# EAGLE board node6.9.16-frontend (EAGLE 5.10), part 1 of 2
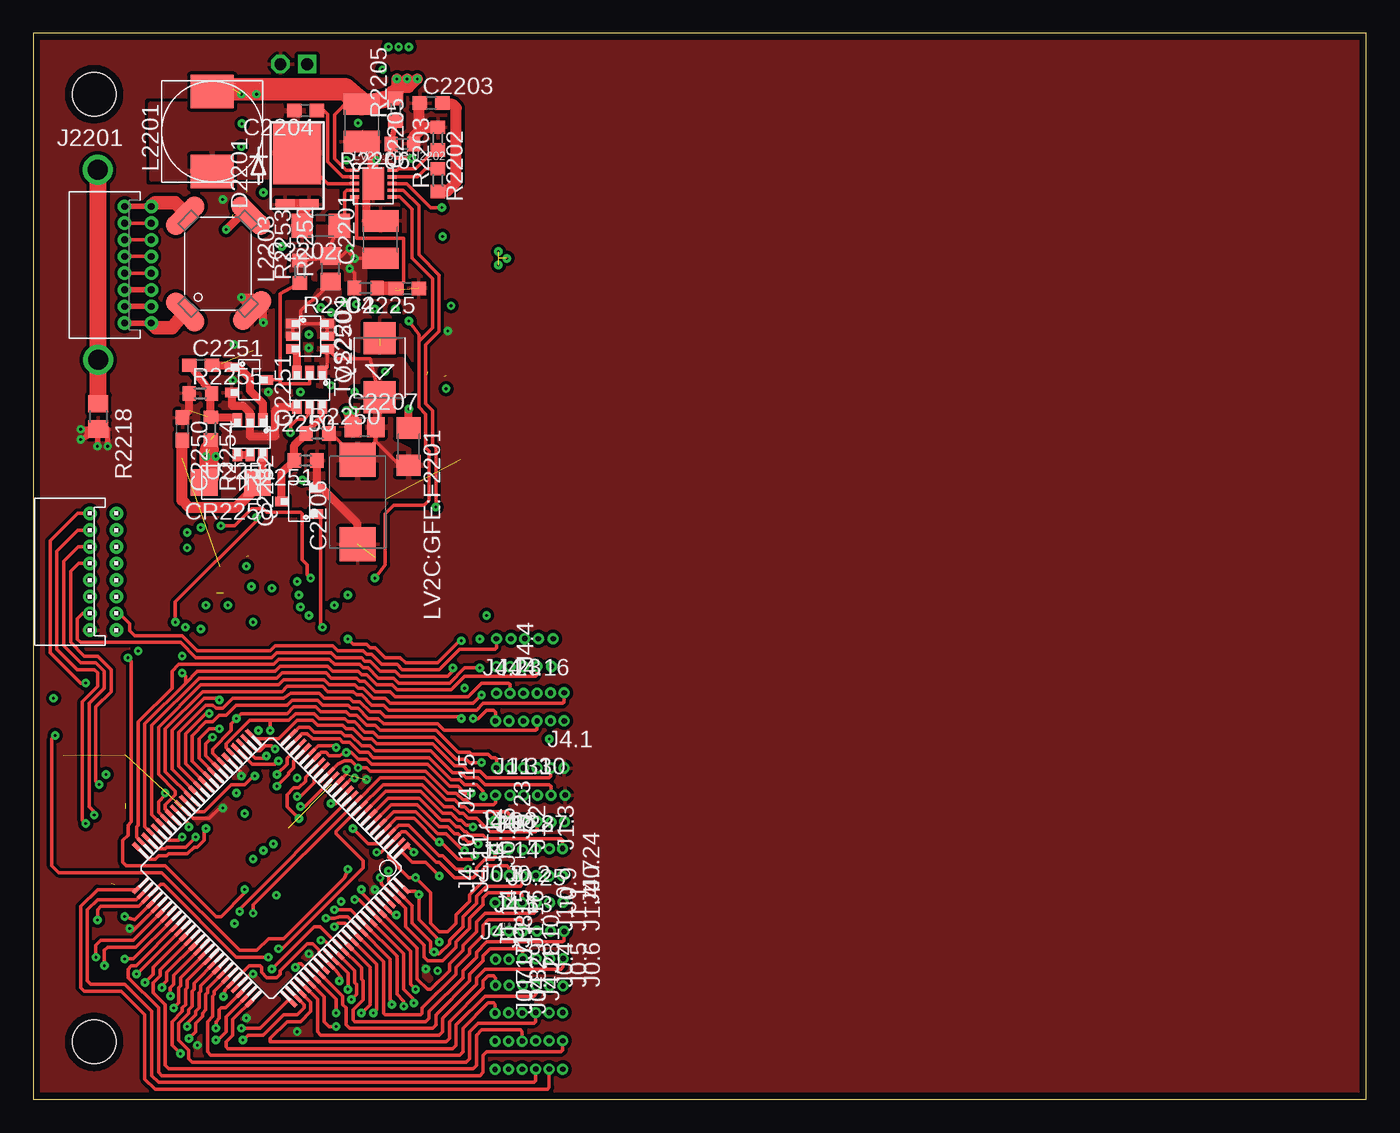
[diagram p2: board, top side]
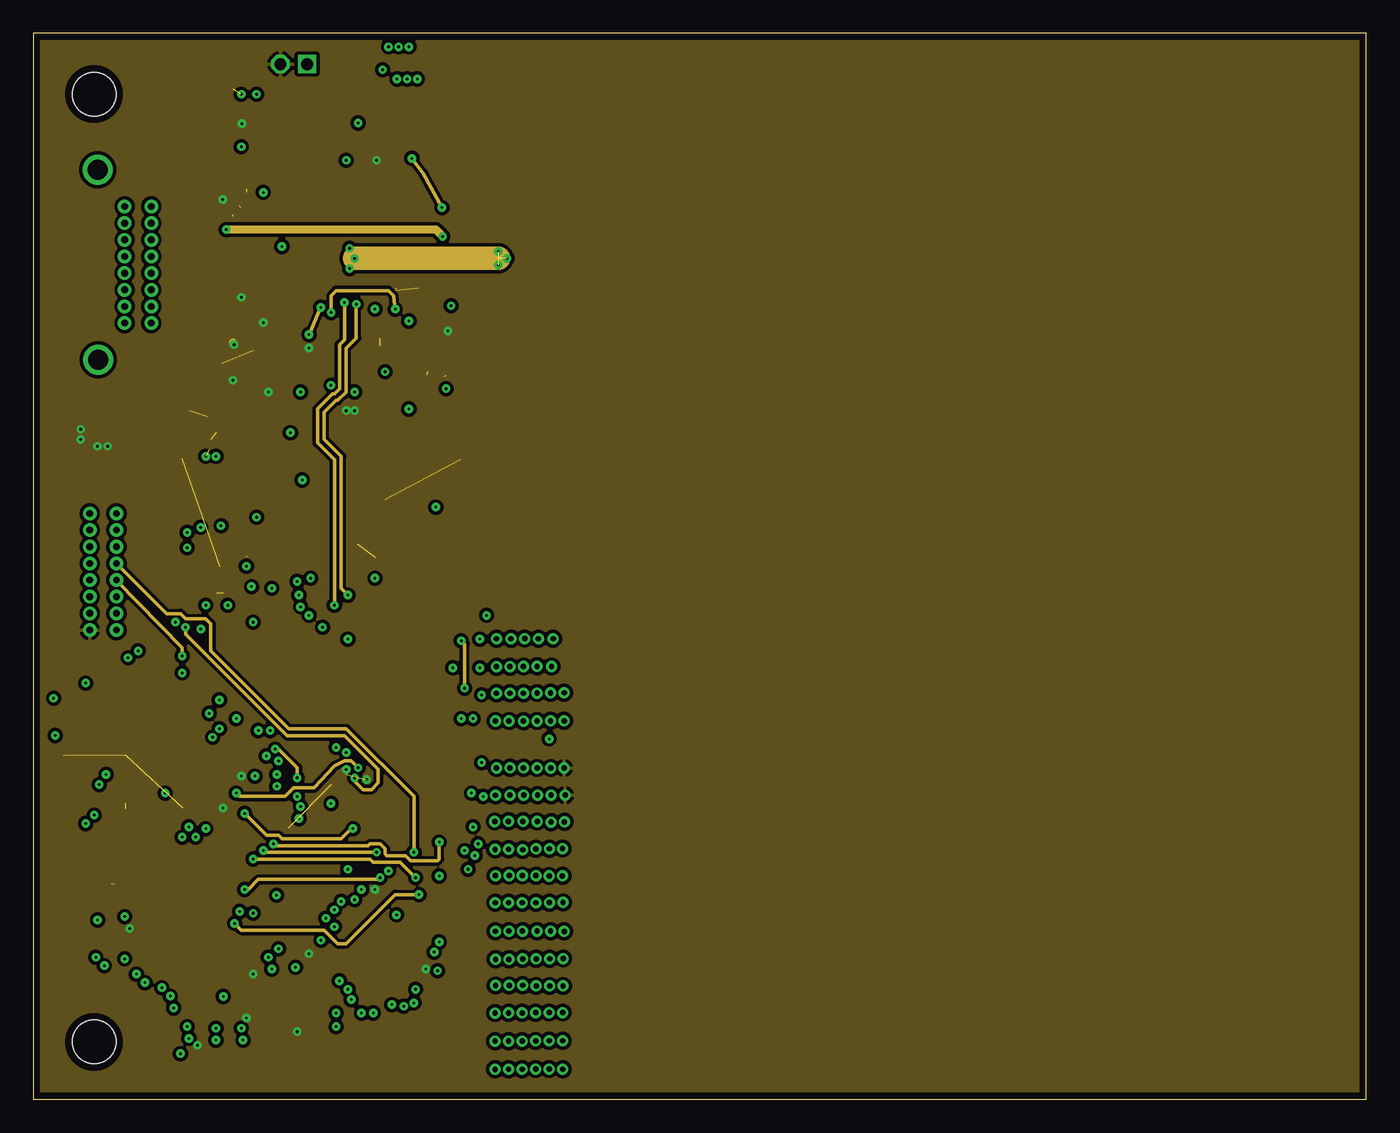
[diagram p3: board, inner layer Route2]
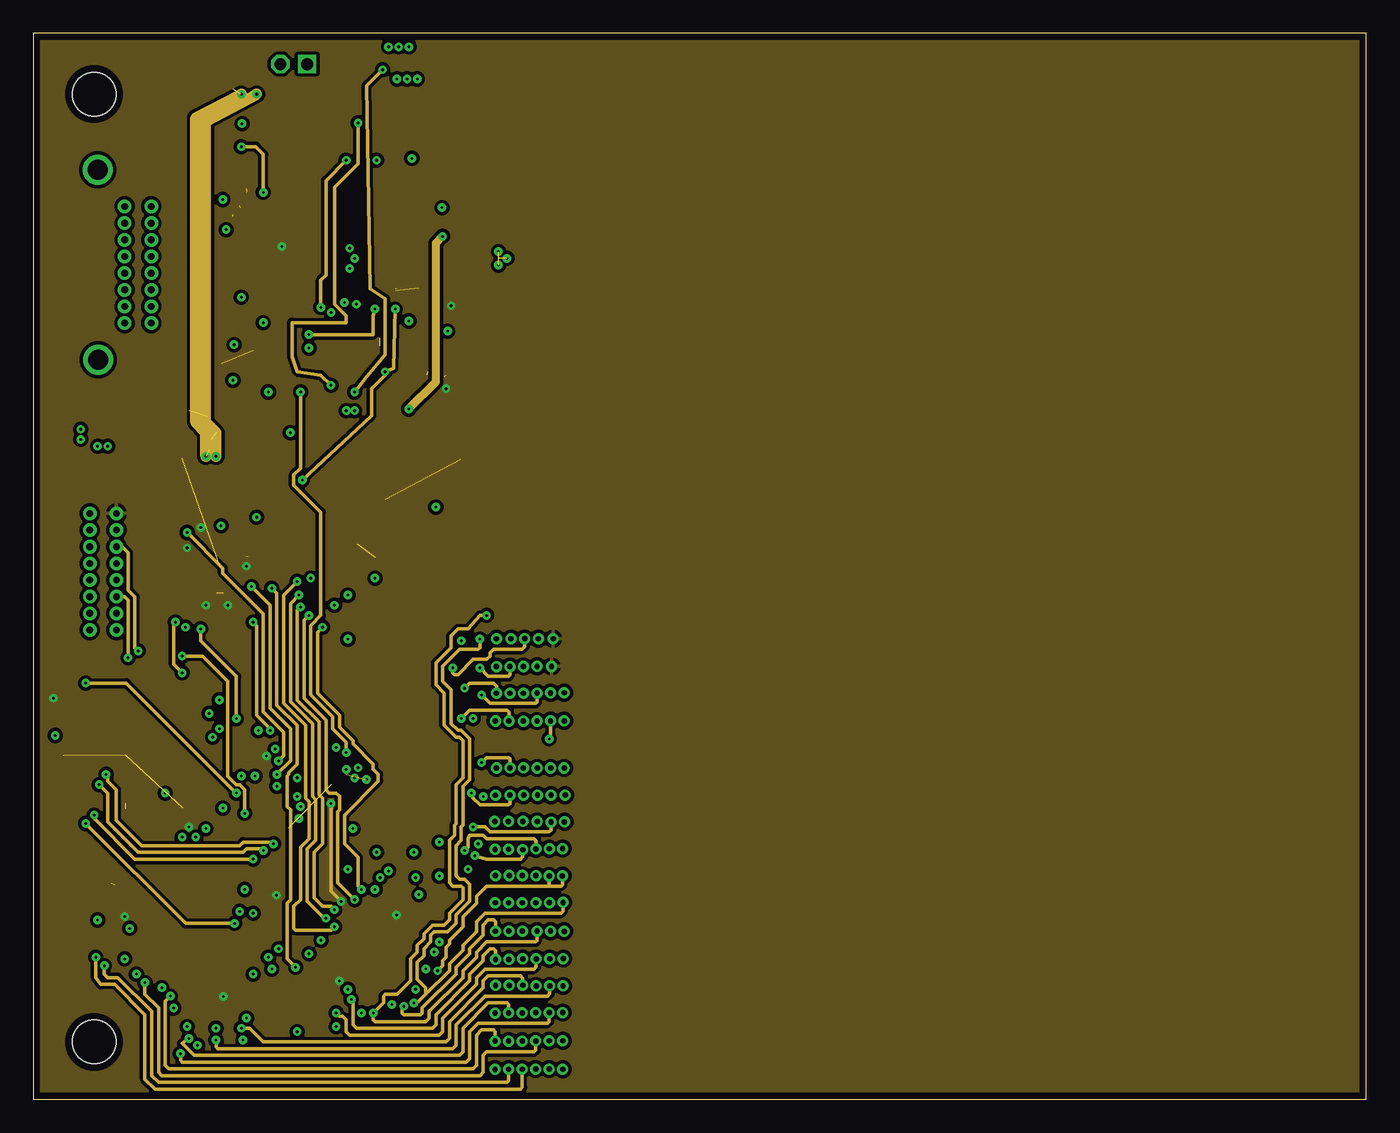
[diagram p4: board, inner layer Route15]
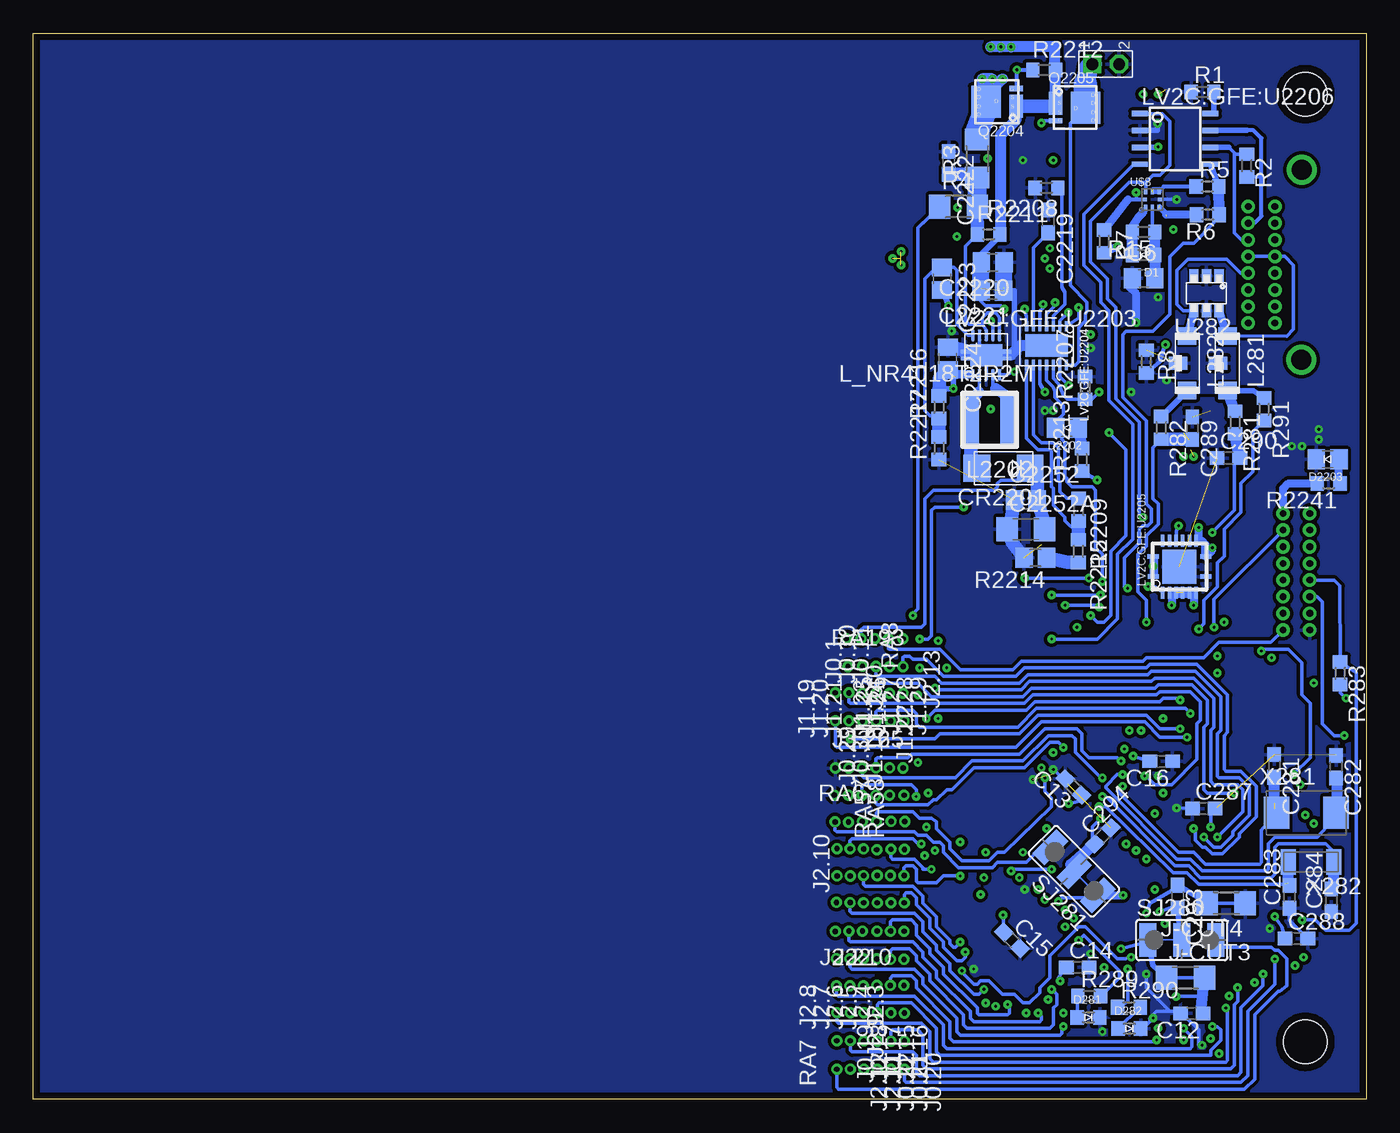
[diagram p5: board, bottom side, seen from below]

Size 100.08 x 80.01 mm. Coordinates in mm from the lower left corner, seen from the top.
Outline: 0,0 100.08,0 100.08,80.01 0,80 0,0
Copper layers (1+2*15+16): Top 0.0432mm / dielectric 0.3048mm / Route2 0.0356mm / dielectric 0.7112mm / Route15 0.0356mm / dielectric 0.3023mm / Bottom 0.0432mm
Design rules "sunstone_4lr_rules_v1.3_modifid *": minimum track width 6mil, minimum drill 8mil, track to track 6mil, track to pad 6mil, pad to pad 6mil, via to via 6mil, smd to smd 6mil, copper to edge 20mil, drill to drill 16mil, minimum pad ring 0.2118mm, minimum via ring 0.2118mm, stop-mask expansion 3mil, vias tented up to drill 0mil, thermal gap 10mil

## Footprints (pad centres in the part's own frame; a part is rotated, then mirrored left to right if it is on the bottom)
2MM-1X2-HEADER = drill 0.889 pad 1.372 square: 1 0,-1 | drill 0.889 pad 1.372 octagon: 2 0,1
C0805 = smd 1.3 x 1.5: 1 -0.85,0; 2 0.85,0
C0603 = smd 1.1 x 1: 1 -0.85,0; 2 0.85,0
C1210 = smd 1.6 x 2.7: 1 -1.4,0; 2 1.4,0
C1206 = smd 1.6 x 1.8: 1 -1.4,0; 2 1.4,0
D/7343-31R = smd 2.55 x 2.7: + 3.175,0; - -3.175,0
NMINIP2-J1 = smd 2 x 2: A 2,0; C -2,0
0603-DIODE = smd 1 x 1.1: A -0.85,0; K 0.85,0
D_POWERDI5 = smd 0.8 x 1.4: ANODE1 -3.47,-0.8; ANODE2 -3.47,1 | smd 4.7 x 3.6: CATHODE 0.4,0.1
0805-DIODE = smd 1.3 x 1.5: 1(ANODE) -0.85,0; 2(CATHODE) 0.85,0
0805-DIODE@1 = smd 1.3 x 1.5: 1(ANODE) -0.85,0; 2(CATHODE) 0.85,0
PAD_ROUND-APC-FREE_0.1/016 = drill 0.406 round: PAD 0,0
ROCKETBUS-PKG = drill 0.508 pad 1.016 round: AUX_1@1 0,-1.875; AUX_1@2 2,-1.875; AUX_2@1 0,-3.125; AUX_2@2 2,-3.125; B+@1 0,4.375; B+@2 2,4.375; B-@1 0,-4.375; B-@2 2,-4.375; CAN_H@1 0,3.125; CAN_H@2 2,3.125; CAN_L@1 0,1.875; CAN_L@2 2,1.875; USB_H@1 0,0.625; USB_H@2 2,0.625; USB_L@1 0,-0.625; USB_L@2 2,-0.625 | drill 1.511 round: CHASSIS@1 -2.032,7.136; CHASSIS@2 -1.982,-7.136
JST-16PS-JED = drill 0.508 pad 1.016 round: 1 4.375,-2; 2 4.375,0; 3 3.125,-2; 4 3.125,0; 5 1.875,-2; 6 1.875,0; 7 0.625,-2; 8 0.625,0; 9 -0.625,-2; 10 -0.625,0; 11 -1.875,-2; 12 -1.875,0; 13 -3.125,-2; 14 -3.125,0; 15 -4.375,-2; 16 -4.375,0
ZJ1206B = smd 1.6 x 1.803: 1 -1.422,0; 2 1.422,0
STAND-OFF = hole 3.302: 0,0
EXC-CET@1 = smd 1.3 x 1.4: 1 -2.05,0; 2 2.05,0 | smd 1 x 1.4: C 0,-0.7
L-DR74 = smd 2.5 x 3.25: 1 -3,0; 2 3,0
L_NR4018 = smd 1.2 x 3.7: 1 -1.4,0; 2 1.4,0
CMS1 = smd 3.5 x 1.5 rotated 45: 1 3.608,-2.462; 3 -3.608,2.462 | smd 3.5 x 1.5 rotated 315: 2 3.508,2.562; 4 -3.608,-2.462
1206 = smd 1.6 x 1.8: 1 -1.4,0; 2 1.4,0
LQFP100 = smd 0.28 x 1.5: #RESET 2,-7.9; #RSTOUT 0.5,-7.9; #TRST -4.5,-7.9; P0[15]/TXD1/SCK0/SCK 0.5,7.9; P0[16]/RXD1/SSEL0/SSEL 0,7.9; P0[17]/CTS1/MISO0/MISO 1,7.9; P0[18]/DCD1/MOSI0/MOSI 1.5,7.9; P0[19]/DSR1/MCICLK/SDA1 2,7.9; P0[20]/DTR1/MCICMD/SCL1 2.5,7.9; P0[21]/RI1/MCIPWR/RD1 3,7.9; P0[22]/RTS1/MCIDAT0/TD1 3.5,7.9; P0[23]/AD0[0]/I2SRX_CLK/CAP3[0] -2,-7.9; P0[24]/AD0[1]/I2SRX_WS/CAP3[1] -2.5,-7.9; P0[25]/AD0[2]/I2SRX_SDA/TXD3 -3,-7.9; P0[26]/AD0[3]/AOUT/RXD3 -3.5,-7.9; P0[27]/SDA0 6,-7.9; P0[28]/SCL0 5.5,-7.9; P1[30]/VBUS/AD0[4] 4,-7.9; P1[31]/SCK1/AD0[5] 3.5,-7.9; P2[0]/PWM1[1]/TXD1/TRACECLK -6,7.9; P2[1]/PWM1[2]/RXD1/PIPESTAT0 -5.5,7.9; P2[2]/PWM1[3]/CTS1/PIPESTAT1 -5,7.9; P2[3]/PWM1[4]/DCD1/PIPESTAT2 -3.5,7.9; P2[4]/PWM1[5]/DSR1/TRACESYNC -3,7.9; P2[5]/PWM1[6]/DTR1/TRACEPKT0 -2.5,7.9; P2[6]/PCAP1[0]/RI1/TRACEPKT1 -2,7.9; P2[7]/RD2/RTS1/TRACEPKT2 -1.5,7.9; P2[8]/TD2/TXD2/TRACEPKT3 -1,7.9; P2[9]/USB_CONNECT/RXD2/EXTIN0 -0.5,7.9; P2[10]/#EINT0 5,7.9; P2[11]/#EINT1/MCIDAT1/I2STX_CLK 5.5,7.9; P2[12]/#EINT2/MCIDAT2/I2STX_WS 6,7.9; RTCX1 1.5,-7.9; RTCX2 2.5,-7.9; TCK -4,-7.9; TDI -5.5,-7.9; TDO -6,-7.9; TMS -5,-7.9; VBAT 3,-7.9; VDD(3V3)@1 4.5,7.9; VDD(3V3)@2 -4,7.9; VDD(DCDC)(3V3) 0,-7.9; VDDA -1.5,-7.9; VREF -0.5,-7.9; VSS 1,-7.9; VSS@3 4,7.9; VSS@4 -4.5,7.9; VSSA -1,-7.9; XTAL1 4.5,-7.9; XTAL2 5,-7.9 | smd 1.5 x 0.28: P0[0]/RD1/TXD3/SDA1 7.9,4; P0[1]/TD1/RXD3/SCL1 7.9,4.5; P0[2]/TXD0 -7.9,-5; P0[3]/RXD0 -7.9,-5.5; P0[4]/I2SRX_CLK/RD2/CAP2[0] -7.9,3.5; P0[5]/I2SRX_WS/TD2/CAP2[1] -7.9,4; P0[6]/I2SRX_SDA/SSEL1/MAT2[0] -7.9,4.5; P0[7]/I2STX_CLK/SCK1/MAT2[1] -7.9,5; P0[8]/I2STX_WS/MISO1/MAT2[2] -7.9,5.5; P0[9]/I2STX_SDA/MOSI1/MAT2[3] -7.9,6; P0[10]/TXD2/SDA2/MAT3[0] 7.9,5; P0[11]/RXD2/SCL2/MAT3[1] 7.9,5.5; P0[29]/USB_D+ 7.9,-4.5; P0[30]/USB_D- 7.9,-4; P1[0]/ENET_TXD0 -7.9,-3.5; P1[1]/ENET_TXD1 -7.9,-3; P1[4]/ENET_TX_EN -7.9,-2.5; P1[8]/ENET_CRS -7.9,-2; P1[9]/ENET_RXD0 -7.9,-1.5; P1[10]/ENET_RXD1 -7.9,-1; P1[14]/ENET_RX_ER -7.9,-0.5; P1[15]/ENET_REF_CLK -7.9,0; P1[16]/ENET_MDC -7.9,0.5; P1[17]/ENET_MDIO -7.9,1; P1[18]/USB_UP_LED/PWM1[1]/CAP1[0] 7.9,-3; P1[19]/CAP1[1] 7.9,-2.5; P1[20]/PWM1[2]/SCK0 7.9,-2; P1[21]/PWM1[3]/SSEL0 7.9,-1.5; P1[22]MAT1[0] 7.9,-1; P1[23]/PWM1[4]/MISO0 7.9,-0.5; P1[24]/PWM1[5]/MOSI0 7.9,0; P1[25]/MAT1[1] 7.9,0.5; P1[26]/PWM1[6]/CAP0[0] 7.9,1; P1[27]/CAP0[1] 7.9,2.5; P1[28]/PCAP1[0]/MAT0[0] 7.9,3; P1[29]/PCAP1[1]/MAT0[1] 7.9,3.5; P2[13]/#EINT3/MCIDAT3/I2STX_SDA 7.9,6; P3[25]/MAT0[0]/PWM1[2] 7.9,-5.5; P3[26]/MAT0[1]/PWM1[3] 7.9,-6; P4[28]/MAT2[0]/TXD3 -7.9,3; P4[29]/MAT2[1]/RXD3 -7.9,1.5; RTCK -7.9,-6; VDD(3V3) 7.9,-5; VDD(3V3)@3 -7.9,-4; VDD(DCDC)(3V3)@1 7.9,2; VDD(DCDC)(3V3)@2 -7.9,2; VSS@1 7.9,-3.5; VSS@2 7.9,1.5; VSS@5 -7.9,-4.5; VSS@6 -7.9,2.5
DFN-10 = smd 0.25 x 0.675: BD -1,-1.413; BOOST -0.5,-1.413; FB 0,1.413; PG 0.5,1.413; RT -1,1.413; RUN/SS 1,-1.413; SW 0,-1.413; SYNC 1,1.413; VC -0.5,1.413; VIN 0.5,-1.413 | smd 2.38 x 1.65: GND 0,0
SON-10 = smd 0.28 x 0.85: EN 1,1.475; FB -1,1.475; GND -0.5,1.475; L1 0.5,-1.475; L2 -0.5,-1.475; PGND 0,-1.475; PS/SYNC 0.5,1.475; VIN 1,-1.475; VINA 0,1.475; VOUT -1,-1.475 | smd 2.4 x 1.65: PGND@1 0,0 | smd 3.8 x 0.28: PGND@2 0,0.25; PGND@3 0,-0.25
DFN-14 = smd 0.25 x 0.7: 1 -1.5,-1.45; 2 -1,-1.45; 3 -0.5,-1.45; 4 0,-1.45; 5 0.5,-1.45; 6 1,-1.45; 7 1.5,-1.45; 8 1.5,1.45; 9 1,1.45; 10 0.5,1.45; 11 0,1.45; 12 -0.5,1.45; 13 -1,1.45; 14 -1.5,1.45 | smd 3.3 x 1.7: PGND 0,0
QFN-16 = smd 0.85 x 0.28: 1 -1.97,-0.75; 8 1.97,-0.74; 9 1.97,0.75; 16 -1.98,0.75 | smd 0.28 x 0.85: 2 -1.25,-1.95; 3 -0.75,-1.95; 4 -0.25,-1.95; 5 0.25,-1.95; 6 0.75,-1.95; 7 1.25,-1.95; 10 1.25,1.95; 11 0.75,1.95; 12 0.25,1.95; 13 -0.25,1.95; 14 -0.75,1.95; 15 -1.25,1.95 | smd 2.55 x 2.55: PGND 0,0
DR-PDSO-G8 = smd 0.4 x 1.2: 1 -1.905,-2.65; 2 -0.635,-2.65; 3 0.635,-2.65; 4 1.905,-2.65; 5 1.905,2.65; 6 0.635,2.65; 7 -0.635,2.65; 8 -1.905,2.65
1212-8_POWERPAK = smd 0.99 x 1.725: 1-2-3 -1.45,0.33 | smd 0.99 x 0.405: 4 -1.45,-0.99 | smd 2.24 x 2.39: 5-6-7-8 0.797,0
SOT23-6 = smd 0.7 x 1: 1 -0.95,-1.3; 2 0,-1.3; 3 0.95,-1.3; 4 0.95,1.3; 5 0,1.3; 6 -0.95,1.3
SOT23-3 = smd 0.7 x 1: 1 -0.95,-1.3; 2 0.95,-1.3; 3 0,1.3
R0603 = smd 1 x 1.1: 1 -0.85,0; 2 0.85,0
R1206 = smd 1.6 x 1.803: 1 -1.422,0; 2 1.422,0
R0805 = smd 1.3 x 1.5: 1 -0.85,0; 2 0.85,0
R0805' = smd 1.3 x 1.5: 1 -0.95,0; 2 0.95,0
SJ_2W = smd 1.27 x 2.54: 1 -2.54,0; 2 0,0; 3 2.54,0
SMB = smd 2.4 x 2.4: A 2.2,0; C -2.2,0
MICROPAK-8 = smd 0.25 x 0.4: 1 -0.5,-0.61; 2 0,-0.61; 3 0.5,-0.61; 5 0.5,0.61; 6 0,0.61; 7 -0.5,0.61 | smd 0.4 x 0.25: 4 0.6,0; 8 -0.6,0
CS10 = smd 1.905 x 2.413: P$1 -2.235,0; P$2 2.235,0
CM415 = smd 1.118 x 1.905: P$1 -1.702,0; P$2 1.702,0

## Placement (x,y rotation side)
B1  BATTERY_SINGLE_CELL_2MM  [2MM-1X2-HEADER]  19.56,77.7 270 bottom
C6  76nF  [C0805]  16.71,61.62 0 bottom
C12  0.1  [C0603]  13.09,6.45 180 bottom
C13  0.1  [C0603]  22,23.44 135 bottom
C14  0.1  [C0603]  21.67,9.91 0 bottom
C15  0.1  [C0603]  26.61,11.94 315 bottom
C16  0.1  [C0603]  15.39,25.37 180 bottom
C281  39 pF  [C0603]  6.91,25.02 270 bottom
C282  33 pF  [C0603]  2.26,24.97 270 bottom
C283  22 pF  [C0603]  5.77,15.19 90 bottom
C284  22 pF  [C0603]  2.62,14.94 90 bottom
C287  0.1  [C0603]  12.19,21.82 0 bottom
C288  0.1  [C0603]  5.23,12.06 0 bottom
C289  18pF  [C0603]  13.06,50.37 270 bottom
C290  18pF  [C0603]  10.34,48.13 0 bottom
C293  0.1  [C0603]  14.17,15.21 270 bottom
C294  0.1  [C0603]  19.78,19.77 45 bottom
C2201  10uF  [C1210]  26.06,64.53 90 top
C2202  1uF  [C1206]  21.59,65.56 180 top
C2203  680pF  [C0603]  29.87,74.77 0 top
C2204  0.22uF  [C0603]  20.44,74.22 180 top
C2205  22uF  [C1210]  24.67,73.28 270 top
C2206  22  [D/7343-31R]  24.35,44.83 90 top
C2207  0.33  [C0805]  24.87,50.44 0 top
C2219  depends on bat  [C0603]  23.88,65.89 270 bottom
C2220  4.7uF  [C0805]  28.04,62.81 180 bottom
C2221  4.7uF  [C0805]  28.07,60.71 180 bottom
C2222  0.1uF  [C0603]  31.34,70.28 270 bottom
C2223  2pF  [C0805]  31.85,61.59 270 bottom
C2224  22uF  [C0805]  31.42,55.6 270 bottom
C2225  0.1uF  [C0603]  28.09,60.86 180 top
C2250  2.7  [C0603]  11.2,50.32 270 top
C2251  0.015  [C0603]  12.57,55.09 0 top
C2252  TBD  [C0805]  25.55,44.98 0 bottom
C2252A  TBD  [C1206]  25.55,42.8 0 bottom
CR2201  MA2Q705  [NMINIP2-J1]  27.23,47.37 180 bottom
CR2250  MA2Q705  [NMINIP2-J1]  14.83,46.3 180 top
D1  CDSU101A  [0603-DIODE]  16.71,63.37 180 bottom
D281  LED-RED-0603  [0603-DIODE]  20.85,6.15 0 bottom
D282  LED-GRN-  [0603-DIODE]  17.78,5.31 0 bottom
D2201  D_PDS340  [D_POWERDI5]  19.91,70.63 90 top
D2202  LED-RED-0805  [0805-DIODE]  22.48,50.39 180 bottom
D2203  LED-ORG-0805  [0805-DIODE@1]  2.9,48.03 180 bottom
J0.0  PAD_ROUND016  [PAD_ROUND-APC-FREE_0.1/016]  34.77,30.48 90 bottom
J0.1  PAD_ROUND016  [PAD_ROUND-APC-FREE_0.1/016]  37.82,32.5 90 bottom
J0.2  PAD_ROUND016  [PAD_ROUND-APC-FREE_0.1/016]  36.7,14.76 0 top
J0.3  PAD_ROUND016  [PAD_ROUND-APC-FREE_0.1/016]  34.68,14.76 0 top
J0.4  PAD_ROUND016  [PAD_ROUND-APC-FREE_0.1/016]  37.76,10.54 270 top
J0.5  PAD_ROUND016  [PAD_ROUND-APC-FREE_0.1/016]  38.77,10.55 270 top
J0.6  PAD_ROUND016  [PAD_ROUND-APC-FREE_0.1/016]  39.79,10.57 270 top
J0.7  PAD_ROUND016  [PAD_ROUND-APC-FREE_0.1/016]  34.71,8.55 270 top
J0.8  PAD_ROUND016  [PAD_ROUND-APC-FREE_0.1/016]  35.73,8.55 270 top
J0.9  PAD_ROUND016  [PAD_ROUND-APC-FREE_0.1/016]  36.74,8.56 270 top
J0.10  PAD_ROUND016  [PAD_ROUND-APC-FREE_0.1/016]  36.8,32.49 90 bottom
J0.11  PAD_ROUND016  [PAD_ROUND-APC-FREE_0.1/016]  35.79,32.47 90 bottom
J0.15  PAD_ROUND016  [PAD_ROUND-APC-FREE_0.1/016]  36.7,4.37 270 bottom
J0.16  PAD_ROUND016  [PAD_ROUND-APC-FREE_0.1/016]  35.69,4.37 270 bottom
J0.17  PAD_ROUND016  [PAD_ROUND-APC-FREE_0.1/016]  37.72,4.38 270 bottom
J0.18  PAD_ROUND016  [PAD_ROUND-APC-FREE_0.1/016]  38.73,4.39 270 bottom
J0.19  PAD_ROUND016  [PAD_ROUND-APC-FREE_0.1/016]  39.75,4.39 270 bottom
J0.20  PAD_ROUND016  [PAD_ROUND-APC-FREE_0.1/016]  34.67,2.25 270 bottom
J0.21  PAD_ROUND016  [PAD_ROUND-APC-FREE_0.1/016]  35.69,2.26 270 bottom
J0.22  PAD_ROUND016  [PAD_ROUND-APC-FREE_0.1/016]  36.7,2.26 270 bottom
J0.23  PAD_ROUND016  [PAD_ROUND-APC-FREE_0.1/016]  38.87,20.8 90 top
J0.24  PAD_ROUND016  [PAD_ROUND-APC-FREE_0.1/016]  39.74,18.82 270 top
J0.25  PAD_ROUND016  [PAD_ROUND-APC-FREE_0.1/016]  38.75,18.81 180 top
J0.26  PAD_ROUND016  [PAD_ROUND-APC-FREE_0.1/016]  37.73,18.8 90 top
J0.27  PAD_ROUND016  [PAD_ROUND-APC-FREE_0.1/016]  38.87,22.83 180 top
J0.28  PAD_ROUND016  [PAD_ROUND-APC-FREE_0.1/016]  37.86,22.83 180 top
J0.29  PAD_ROUND016  [PAD_ROUND-APC-FREE_0.1/016]  36.8,24.88 90 bottom
J0.30  PAD_ROUND016  [PAD_ROUND-APC-FREE_0.1/016]  35.79,24.88 90 bottom
J1.0  PAD_ROUND016  [PAD_ROUND-APC-FREE_0.1/016]  37.74,14.75 270 top
J1.1  PAD_ROUND016  [PAD_ROUND-APC-FREE_0.1/016]  38.76,14.76 270 top
J1.2  PAD_ROUND016  [PAD_ROUND-APC-FREE_0.1/016]  35.67,20.87 270 top
J1.3  PAD_ROUND016  [PAD_ROUND-APC-FREE_0.1/016]  37.83,20.85 270 top
J1.4  PAD_ROUND016  [PAD_ROUND-APC-FREE_0.1/016]  39.77,14.78 270 top
J1.8  PAD_ROUND016  [PAD_ROUND-APC-FREE_0.1/016]  34.69,12.62 270 top
J1.9  PAD_ROUND016  [PAD_ROUND-APC-FREE_0.1/016]  35.71,12.63 270 top
J1.10  PAD_ROUND016  [PAD_ROUND-APC-FREE_0.1/016]  36.72,12.63 270 top
J1.14  PAD_ROUND016  [PAD_ROUND-APC-FREE_0.1/016]  37.82,12.62 90 top
J1.15  PAD_ROUND016  [PAD_ROUND-APC-FREE_0.1/016]  38.84,12.62 90 top
J1.16  PAD_ROUND016  [PAD_ROUND-APC-FREE_0.1/016]  39.85,12.61 90 top
J1.17  PAD_ROUND016  [PAD_ROUND-APC-FREE_0.1/016]  34.71,10.5 270 top
J1.18  PAD_ROUND016  [PAD_ROUND-APC-FREE_0.1/016]  34.77,24.87 90 bottom
J1.19  PAD_ROUND016  [PAD_ROUND-APC-FREE_0.1/016]  39.85,28.41 90 bottom
J1.20  PAD_ROUND016  [PAD_ROUND-APC-FREE_0.1/016]  38.84,28.41 90 bottom
J1.21  PAD_ROUND016  [PAD_ROUND-APC-FREE_0.1/016]  37.82,28.4 90 bottom
J1.22  PAD_ROUND016  [PAD_ROUND-APC-FREE_0.1/016]  36.8,28.38 270 bottom
J1.23  PAD_ROUND016  [PAD_ROUND-APC-FREE_0.1/016]  35.71,28.4 90 bottom
J1.24  PAD_ROUND016  [PAD_ROUND-APC-FREE_0.1/016]  34.7,28.4 90 bottom
J1.25  PAD_ROUND016  [PAD_ROUND-APC-FREE_0.1/016]  39.85,30.52 270 bottom
J1.26  PAD_ROUND016  [PAD_ROUND-APC-FREE_0.1/016]  38.84,30.51 270 bottom
J1.27  PAD_ROUND016  [PAD_ROUND-APC-FREE_0.1/016]  37.82,30.49 270 bottom
J1.28  PAD_ROUND016  [PAD_ROUND-APC-FREE_0.1/016]  36.8,30.48 270 bottom
J1.29  PAD_ROUND016  [PAD_ROUND-APC-FREE_0.1/016]  35.79,30.48 270 bottom
J1.30  PAD_ROUND016  [PAD_ROUND-APC-FREE_0.1/016]  36.82,22.83 0 top
J1.31  PAD_ROUND016  [PAD_ROUND-APC-FREE_0.1/016]  35.79,22.83 0 top
J2.0  PAD_ROUND016  [PAD_ROUND-APC-FREE_0.1/016]  37.76,8.51 0 bottom
J2.1  PAD_ROUND016  [PAD_ROUND-APC-FREE_0.1/016]  38.77,8.51 0 bottom
J2.2  PAD_ROUND016  [PAD_ROUND-APC-FREE_0.1/016]  39.78,8.51 0 bottom
J2.3  PAD_ROUND016  [PAD_ROUND-APC-FREE_0.1/016]  34.67,6.48 90 bottom
J2.4  PAD_ROUND016  [PAD_ROUND-APC-FREE_0.1/016]  35.69,6.49 90 bottom
J2.5  PAD_ROUND016  [PAD_ROUND-APC-FREE_0.1/016]  36.7,6.49 90 bottom
J2.6  PAD_ROUND016  [PAD_ROUND-APC-FREE_0.1/016]  37.72,6.5 90 bottom
J2.7  PAD_ROUND016  [PAD_ROUND-APC-FREE_0.1/016]  38.73,6.52 90 bottom
J2.8  PAD_ROUND016  [PAD_ROUND-APC-FREE_0.1/016]  39.75,6.52 90 bottom
J2.9  PAD_ROUND016  [PAD_ROUND-APC-FREE_0.1/016]  34.67,4.37 90 bottom
J2.10  PAD_ROUND016  [PAD_ROUND-APC-FREE_0.1/016]  38.73,16.76 90 bottom
J2.11  PAD_ROUND016  [PAD_ROUND-APC-FREE_0.1/016]  37.72,2.27 270 bottom
J2.12  PAD_ROUND016  [PAD_ROUND-APC-FREE_0.1/016]  38.73,2.27 270 bottom
J2.13  PAD_ROUND016  [PAD_ROUND-APC-FREE_0.1/016]  34.77,32.47 270 bottom
J3.25  PAD_ROUND016  [PAD_ROUND-APC-FREE_0.1/016]  37.83,24.87 0 bottom
J3.26  PAD_ROUND016  [PAD_ROUND-APC-FREE_0.1/016]  38.85,24.87 0 bottom
J4.1  PAD_ROUND016  [PAD_ROUND-APC-FREE_0.1/016]  39.85,24.87 0 top
J4.2  PAD_ROUND016  [PAD_ROUND-APC-FREE_0.1/016]  35.86,34.57 180 top
J4.3  PAD_ROUND016  [PAD_ROUND-APC-FREE_0.1/016]  36.89,34.58 180 top
J4.4  PAD_ROUND016  [PAD_ROUND-APC-FREE_0.1/016]  34.77,34.57 270 top
J4.5  PAD_ROUND016  [PAD_ROUND-APC-FREE_0.1/016]  36.72,16.8 180 top
J4.6  PAD_ROUND016  [PAD_ROUND-APC-FREE_0.1/016]  35.69,14.76 180 top
J4.7  PAD_ROUND016  [PAD_ROUND-APC-FREE_0.1/016]  39.73,16.78 270 top
J4.8  PAD_ROUND016  [PAD_ROUND-APC-FREE_0.1/016]  35.69,18.77 0 top
J4.9  PAD_ROUND016  [PAD_ROUND-APC-FREE_0.1/016]  34.67,18.76 0 top
J4.10  PAD_ROUND016  [PAD_ROUND-APC-FREE_0.1/016]  34.7,16.79 90 top
J4.11  PAD_ROUND016  [PAD_ROUND-APC-FREE_0.1/016]  35.73,16.8 90 top
J4.12  PAD_ROUND016  [PAD_ROUND-APC-FREE_0.1/016]  36.74,18.73 90 top
J4.13  PAD_ROUND016  [PAD_ROUND-APC-FREE_0.1/016]  37.74,16.79 180 top
J4.14  PAD_ROUND016  [PAD_ROUND-APC-FREE_0.1/016]  36.77,20.87 180 top
J4.15  PAD_ROUND016  [PAD_ROUND-APC-FREE_0.1/016]  34.7,22.82 90 top
J4.16  PAD_ROUND016  [PAD_ROUND-APC-FREE_0.1/016]  39.03,34.57 180 top
J4.28  PAD_ROUND016  [PAD_ROUND-APC-FREE_0.1/016]  36.74,10.54 270 top
J4.29  PAD_ROUND016  [PAD_ROUND-APC-FREE_0.1/016]  35.71,10.5 270 top
J2201  ROCKETBUS  [ROCKETBUS-PKG]  6.86,62.64 0 top
J2204  JST-16PS-JED  [JST-16PS-JED]  4.24,39.6 90 top
J-CUT3  J_CUT_1206  [ZJ1206B]  13.56,9.12 0 bottom
J-CUT4  J_CUT_1206  [ZJ1206B]  10.52,14.73 180 bottom
JP1  STAND-OFF  [STAND-OFF]  4.57,75.44 0 top
JP2  STAND-OFF  [STAND-OFF]  4.57,4.32 0 top
L281  EXC-CET471U  [EXC-CET@1]  10.41,55.24 270 bottom
L282  FILTER_EMI-EXC-CET  [EXC-CET@1]  13.44,55.24 270 bottom
L2201  L_DR74-6R8-R  [L-DR74]  13.43,72.64 90 top
L2202  L_NR4018T2R2M  [L_NR4018]  28.27,51.01 180 bottom
L2203  CMS1  [CMS1]  13.87,62.71 270 top
LV2C:GFE:F2201  2.0A Fast  [1206]  28.17,49 270 top
LV2C:GFE:U2201  IC_LPC2368  [LQFP100]  17.86,17.35 135 top
LV2C:GFE:U2202  IC_LT3972  [DFN-10]  25.52,68.74 270 top
LV2C:GFE:U2203  IC_TPS63000  [SON-10]  28.53,55.86 0 bottom
LV2C:GFE:U2204  IC_LTC4085  [DFN-14]  24,56.56 180 bottom
LV2C:GFE:U2205  IC_SN74LV163A  [QFN-16]  14.02,39.98 0 bottom
LV2C:GFE:U2206  IC_SN65HVD235  [DR-PDSO-G8]  14.35,72.09 270 bottom
Q2204  P-MOS_SI7123DN  [1212-8_POWERPAK]  27.73,74.87 180 bottom
Q2205  P-MOS_SI7123DN  [1212-8_POWERPAK]  21.86,74.43 0 bottom
Q2250  ZXMP6A17E6TA  [SOT23-6]  20.78,57.28 270 top
Q2251  BSS123E6327  [SOT23-3]  16.21,54 270 top
Q2282  BSS123E6327  [SOT23-3]  19.96,44.88 90 top
R1  18k  [R0603]  12.29,75.62 0 bottom
R2  60  [R0603]  8.97,70.08 270 bottom
R3  100k  [R1206]  29.21,70.61 90 bottom
R4  100k  [R1206]  30.61,67.01 0 bottom
R5  0  [R0603]  11.91,68.5 0 bottom
R6  0  [R0603]  11.89,66.4 180 bottom
R7  0  [R0603]  19.68,64.39 270 bottom
R8  0  [R0603]  16.51,55.37 270 bottom
R15  10k  [R0603]  16.71,65.1 180 bottom
R281  33.2  [R0603]  9.86,50.8 270 bottom
R282  33.2  [R0603]  15.39,50.39 270 bottom
R283  10.0k  [R0603]  1.96,31.98 270 bottom
R289  649  [R0603]  20.8,7.75 0 bottom
R290  649  [R0603]  17.81,6.91 0 bottom
R291  1.5k  [R0603]  7.67,51.79 270 bottom
R2202  26.7k  [R0603]  30.37,72.11 270 top
R2203  15k  [R0603]  30.38,68.99 90 top
R2204  500k  [R0603]  24.97,60.89 180 top
R2205  532k  [R0603]  27.21,74.27 90 top
R2206  100k  [R0603]  27.71,71.71 180 top
R2207  100k  [R0603]  21.11,53.39 90 bottom
R2208  660  [R0603]  24,68.4 180 bottom
R2209  115k 1%  [R0603]  21.59,44.25 270 bottom
R2211  100  [R0603]  28.35,64.92 0 bottom
R2212  1k  [R0603]  24.18,77.27 0 bottom
R2213  510  [R0603]  21.34,48.01 90 bottom
R2214  Thermistor-100k @25C  [R0805]  24.84,40.64 180 bottom
R2215  15k 1%  [R0603]  21.62,41.15 270 bottom
R2216  1.0M  [R0603]  32.08,51.94 90 bottom
R2217  200k  [R0603]  32.08,48.87 90 bottom
R2218  100k  [R0805']  4.88,51.26 270 top
R2241  649  [R0603]  2.82,46.23 180 bottom
R2250  61.9k  [R0603]  21.34,49.97 0 top
R2251  10.0k  [R0603]  20.45,47.94 180 top
R2252  0.82  [R0805']  22.32,62.34 90 top
R2253  47k  [R0603]  20.02,62.12 90 top
R2254  33.0k  [R0603]  13.34,50.34 270 top
R2255  10.0k  [R0603]  12.55,52.98 0 top
RA6  t24  [PAD_ROUND-APC-FREE_0.1/016]  39.88,20.83 0 bottom
RA7  t24  [PAD_ROUND-APC-FREE_0.1/016]  39.75,2.26 90 bottom
RA8  t24  [PAD_ROUND-APC-FREE_0.1/016]  37.92,34.57 270 bottom
RA57  t24  [PAD_ROUND-APC-FREE_0.1/016]  39.93,22.83 270 bottom
RA58  t24  [PAD_ROUND-APC-FREE_0.1/016]  34.65,20.85 90 bottom
RA193  3P3  [PAD_ROUND-APC-FREE_0.1/016]  38.91,32.49 0 bottom
SJ280  [SJ_2W]  13.84,11.96 0 bottom
SJ281  [SJ_2W]  21.93,17.11 135 bottom
TVS2201  SMBJ18A  [SMB]  26,54.91 90 top
U282  SN65220DBVR  [SOT23-6]  11.99,60.5 180 bottom
U2250  MAX5902AAETT  [SOT23-6]  20.75,53.26 180 top
U2251  TLV3012AIDBVT  [SOT23-6]  16.28,49.68 180 top
U$8  IC_NC7NP14  [MICROPAK-8]  16.05,67.54 0 bottom
X281  12.0 MHz  [CS10]  4.5,21.51 0 bottom
X282  32.768 kHz  [CM415]  4.14,17.81 180 bottom

## Tracks (layer width: path | path; a pad name or v marks a point on that pad's centre or on a via)
3.3V_HAP_OUT  (via drill 0.2)  (4 unrouted)
  Top 0.254: v22.98,8.89 23.11,9.14 22.73,9.65 LV2C:GFE:U2201.VDD(DCDC)(3V3)@2 21.46,10.91 21.46,11.18 20.95,11.68 20.57,11.68 18.54,9.65 18.54,9.4 18.29,9.14 17.53,9.14 17.14,9.53 17.14,9.91 17.02,10.03 16.2,10.03 LV2C:GFE:U2201.VDD(3V3)@2 14.39,8.23 v14.27,7.72 | LV2C:GFE:U2201.VDD(3V3)@1 7.61,13.46 v6.86,13.72 | LV2C:GFE:U2201.VDD(3V3)@3 27.02,13.84 v27.27,13.84 | v22.35,22.2 22.71,22.2 LV2C:GFE:U2201.VDD(DCDC)(3V3) | LV2C:GFE:U2201.VDD(3V3) 16.66,25.61 17.48,25.61 v17.5,25.77 | LV2C:GFE:U2201.VDD(DCDC)(3V3)@1 11.68,20.7 v11.68,20.45
  Route15 0.254: 22.35,22.23 22.35,15.62 v23.11,14.86
  Bottom 0.254: C2224.2 31.42,54.38 LV2C:GFE:U2203.VOUT | 29.59,54.23 30.86,54.23 | 29.59,54.61 30.99,54.61 | C16.2 v17.5,25.77 | C15.1 v27.27,13.84 | C14.1 22.73,9.65 23.11,9.14 v22.98,8.89 | LV2C:GFE:U2205.4 LV2C:GFE:U2205.3 14.61,38.12 | LV2C:GFE:U2205.7 12.95,38.1 | C12.1 12.37,7.48 12.62,7.72 v14.27,7.72 | C288.1 6.34,12.94 v6.86,13.72 | LV2C:GFE:U2205.1 15.99,39.74 v16,40.01 16,40.6 LV2C:GFE:U2205.16 | R283.2 1.96,30.53 v1.52,30.1 | v22.35,22.2 21.39,22.39 C13.1 | C287.2 11.75,21.46 11.68,21.4 11.68,20.83 v11.68,20.45 | v23.11,14.86 22.86,15.11 21.08,15.11 | 12.32,41.91 LV2C:GFE:U2205.10 12.57,42 | 16.13,40.77 15.75,40.77 15.75,39.24 16.13,39.24 16.13,40.77
  Bottom 0.406: C2223.2 31.75,60.64 v31.37,59.56 | C2224.2 30.99,54.32 v30.99,53.34 32,53.34
  Bottom 0.61: R7.2 19.3,63.75 v18.67,64.01 | 12.95,38.1 v12.95,37.08 | 14.61,38.12 v14.61,37.08 | SJ281.1 v18.26,15.32 | R2241.2 5.84,46.23 6.24,45.83 J2204.1 | v11.56,41.4 11.56,41.22 LV2C:GFE:U2205.9 12.06,40.74 12.06,41.66 12.32,41.91 | 12.57,42 v12.57,42.93
  Bottom 0.813: LV2C:GFE:U2205.6 LV2C:GFE:U2205.4 | C12.1 12.37,6.83 J-CUT3.2
  Bottom 1.016: R2216.2 32.05,54.09 C2224.2
  pour Route15 (isolate 0.254, rank 4): 0,80.01 100.08,80.01 100.08,0 0,0
!RESET!  (via drill 0.2)
  Top 0.254: J4.15.PAD 34.7,22.25 34.54,22.1 32.89,22.1 32.51,22.48 32.26,22.48 31.75,22.99 31.11,22.99 29.46,24.64 25.27,24.64 25.02,24.89 v24.38,24.89 23.88,25.4 23.37,25.4 22.86,25.15 22.73,25.05 LV2C:GFE:U2201.#RESET | J2204.2 3.33,43.97 1.27,41.91 1.27,33.53 3.56,31.24 v3.94,31.24
  Route2 0.254: v15.24,22.99 15.49,22.73 18.92,22.73 19.56,23.37 21.08,23.37 22.61,25.02 23.37,25.4 23.88,25.4 v24.38,24.89
  Route15 0.254: v3.94,31.24 6.99,31.24 v15.24,22.99
!RSTOUT!  (via drill 0.2)
  Top 0.254: LV2C:GFE:U2201.#RSTOUT 23.8,24 v24.13,24.13
  Route2 0.254: v11.43,35.43 11.43,34.92 19.05,27.3 23.37,27.3 25.91,24.77 25.91,23.75 25.4,23.24 24.77,23.24 24.13,23.88 v24.13,24.13
  Bottom 0.254: J4.14.PAD 36.77,21.53 36.7,21.59 34.04,21.59 33.53,21.08 32.64,21.08 32.26,20.83 32.26,20.32 31.24,19.3 31.24,18.8 30.35,17.91 28.32,17.91 27.69,18.54 27.18,18.54 23.62,21.97 23.62,22.61 24.13,23.11 v24.13,24.13 | J2204.3 11.43,37.53 v11.43,35.43
!SPS_POWER_PRESENT!  (via drill 0.2)
  Route15 0.254: v24.13,53.09 25.02,54.23 26.42,55.88 26.42,60.07 25.27,60.83 25.02,76.07 v26.23,77.28
  Bottom 0.254: LV2C:GFE:U2204.10 24.5,53.71 v24.13,53.09 | 26.28,77.27 26.24,77.27 v26.23,77.28
  Bottom 0.305: Q2204.4 26.28,77.27 R2212.1
!TRST!  (via drill 0.2)
  Top 0.254: v32.64,17.27 31.75,17.27 30.73,18.29 30.48,18.29 28.19,20.57 27.45,20.57 LV2C:GFE:U2201.#TRST 26.04,19.18 25.15,19.18 v24,20.32
  Route2 0.254: J2204.9 11.18,33.91 v11.18,33.27 | v15.88,21.46 17.53,19.81 18.41,19.81 18.67,19.56 23.11,19.56 23.88,20.32 v24,20.32
  Route15 0.254: v11.18,33.27 12.7,33.27 14.61,31.37 14.61,24.26 15.24,23.62 15.49,23.62 15.88,23.24 v15.88,21.46
  Bottom 0.254: v32.64,17.27 33.27,17.27 33.27,17.4 33.91,18.03 35.56,18.03 35.69,18.16 J4.8.PAD
A_3P3  (via drill 0.2)
  Top 0.254: v18.41,11.3 18.67,11.3 24.77,17.4 24.77,17.91 22.73,19.94 22.73,20.1 LV2C:GFE:U2201.VDDA 26.25,23.62 29.21,23.62 30.86,21.97 31.5,21.97 32,21.46 32.26,21.46 32.64,21.08 33.27,21.08 34.29,20.07 37.72,20.07 37.83,20.18 J1.3.PAD
  Bottom 0.254: SJ280.1 16.38,11.81 v18.41,11.3
  Bottom 0.406: SJ280.1 16,10.06 J-CUT3.1
A_GND  (via drill 0.2)
  Top 0.254: v16.51,13.97 16.51,14.59 LV2C:GFE:U2201.VSSA 26.05,24.13 29.34,24.13 30.99,22.48 31.62,22.48 32.13,21.97 32.38,21.97 32.77,21.59 34.54,21.59 | 34.54,21.59 35.56,21.59 35.67,21.48 J1.2.PAD | RA58.PAD 34.65,21.49 34.54,21.59
  Bottom 0.254: C293.1 13.91,16.07 16.26,14.73 v16.51,13.97
  Bottom 0.406: J-CUT4.2 13.91,15.94 C293.1
AUX_1.2
  Top 0.406: J2201.AUX_1@1 J2201.AUX_1@2
AUX_2.2
  Top 0.406: J2201.AUX_2@1 J2201.AUX_2@2
BATTERY_CHARGE
  Bottom 0.254: LV2C:GFE:U2204.14 21.85,55.11 21.59,55.37 21.59,57.91 21.08,58.42 21.08,58.93 20.95,59.18 20.95,59.82 22.23,61.09 22.23,73.27 Q2205.5-6-7-8
  Bottom 1.422: B1.1 20.83,77.44 21.08,76.2
  Bottom 1.778: 21.08,76.2 21.08,74.2 Q2205.5-6-7-8
BATTERY_CONNECT_CONTROL  (via drill 0.2)
  Route15 0.254: v22.35,53.59 21.59,54.36 19.81,54.61 19.43,55.75 19.43,58.29 23.5,58.29 23.5,58.8 22.61,59.69 22.61,68.45 24.38,70.23 v24.38,73.28
  Bottom 0.254: LV2C:GFE:U2204.13 23,54.24 v22.35,53.59 | Q2205.4 24.22,73.44 v24.38,73.28
BIAS_VOLTS_FOR_NTC_THERMISTOR
  Bottom 0.254: LV2C:GFE:U2204.9 25,49.89 24.38,49.28 23.5,49.28 23.11,48.9 23.11,46.48 22.99,46.35 22.99,45.59 22.49,45.1 R2209.1
BIN  (via drill 0.2)
  Top 0.61: LV2C:GFE:F2201.1 28.19,50.42 v28.19,51.82 | L2203.3 15.52,66.32 v14.48,65.28
  Route2 0.61: v14.48,65.28 30.23,65.28 v30.73,64.77
  Route15 0.61: v28.19,51.82 30.23,53.85 30.23,64.26 v30.73,64.77
CAN1_H
  Top 0.254: J2201.CAN_H@1 J2201.CAN_H@2
  Bottom 0.254: R2.2 8.02,69.23 7.87,69.09
  Bottom 0.305: J2201.CAN_H@2 8.41,65.76 7.87,66.29 7.87,69.09 7.87,72.14 8.46,72.72 8.97,72.72
  Bottom 0.406: 8.97,72.72 LV2C:GFE:U2206.7
CAN1_L
  Top 0.254: J2201.CAN_L@1 J2201.CAN_L@2
  Bottom 0.254: J2201.CAN_L@2 9.39,64.51 9.91,65.02 9.91,70.87 | 9.91,70.87 9.91,71.03 10.32,71.45 | R2.1 9.84,70.93 9.91,70.87
  Bottom 0.406: 10.32,71.45 LV2C:GFE:U2206.6
CHARGE_TIMER
  Bottom 0.254: LV2C:GFE:U2204.6 25,63.91 C2219.2
CHASSIS
  Top 1.27: J2201.CHASSIS@1 4.88,69.77 J2201.CHASSIS@2 R2218.1
CPU_VBAT  (via drill 0.2)
  Top 0.254: LV2C:GFE:U2201.VBAT 20.45,24.18 20.45,23.88 19.94,23.37 19.56,23.37 19.05,22.86 19.05,21.97 v19.94,21.08
  Bottom 0.254: C294.1 20.57,19.62 20.57,20.45 v19.94,21.08
  Bottom 0.813: SJ281.2 22.18,17.62 C294.1
CPU_VREF  (via drill 0.2)
  Top 0.254: LV2C:GFE:U2201.VREF 15.49,14.28 v15.49,14.1
  Bottom 0.254: C293.2 14.72,14.37 v15.49,14.1
  Bottom 0.406: C293.2 13.84,11.65 SJ280.2
CPU_XTAL1  (via drill 0.2)  (1 unrouted)
  Top 0.254: LV2C:GFE:U2201.XTAL1 19.56,25.41 19.56,24.89 19.18,24.51 19.18,24.38 v18.29,23.5
  Bottom 0.254: 6.91,22.23 7.37,20.83 7.87,20.19 7.87,17.78 8,17.65 12.06,17.65 12.95,18.54 14.1,18.54 18.67,23.11 v18.29,23.5
  Bottom 0.813: X281.P$1 6.91,21.82 C281.2
CPU_XTAL2  (via drill 0.2)
  Top 0.254: LV2C:GFE:U2201.XTAL2 19.05,25.61 19.05,25.15 v18.29,24.38
  Route15 0.254: v18.29,24.38 19.3,25.4 19.3,27.81 17.78,29.34 17.78,37.08 v16.38,38.48
  Bottom 0.254: C282.2 2.26,21.23 3.68,19.68 6.86,19.68 7.37,19.18 7.37,17.27 7.49,17.14 12.32,17.14 13.21,18.03 14.22,18.03 19.56,23.37 19.56,23.5 18.67,24.38 v18.29,24.38 | LV2C:GFE:U2205.2 15.85,38.48 v16.38,38.48
  Bottom 0.813: X281.P$2 2.13,23.99 C282.2
DEBUG.13
  Top 0.254: J2204.13 6.39,36.32 6.6,36.32 7.24,35.69 7.24,35.18 7.62,34.8 11.18,34.8 12.32,33.66 17.78,33.66 18.16,34.04 22.48,34.04 22.86,33.66 24.77,33.66 25.02,33.4 25.4,33.4 26.16,32.64 27.3,32.64 27.69,32.26 30.48,32.26 32,33.78 34.67,33.78 34.77,33.88 J4.4.PAD
DEBUG.14  (via drill 0.2)
  Top 0.254: J2204.14 3.71,36.47 3.3,36.07 3.3,34.54 3.56,34.29 11.05,34.29 12.19,33.15 17.91,33.15 18.29,33.53 22.35,33.53 22.73,33.15 24.64,33.15 24.89,32.89 25.27,32.89 26.04,32.13 27.18,32.13 27.56,31.75 31.11,31.75 31.5,32.13 v31.5,32.38
  Route15 0.254: v31.5,32.38 31.5,32 31.62,31.88 31.88,31.88 33.02,33.02 34.04,33.02 34.29,33.27 34.29,33.53 34.54,33.78 36.7,33.78 36.89,33.97 J4.3.PAD
DEBUG.15
  Bottom 0.254: J2204.15 7.17,34.29 11.05,34.29 12.19,33.15 16.51,33.15 16.76,32.89 25.91,32.89 26.54,32.26 30.48,32.26 32,33.78 35.81,33.78 35.87,33.83 J4.2.PAD
DOMINANT_BIT_STUCK_WHEN_HIGH
  Bottom 0.254: U$8.2 16.05,65.17 R15.1
  Bottom 0.813: C6.2 D1.A R15.1
EXT_VBAT
  Bottom 0.254: SJ281.3 24.09,19.05 24.38,18.92 25.53,17.78 27.69,17.78 28.07,17.4 30.61,17.4 31.75,18.54 31.75,19.05 32,19.3 32.51,19.3 33.02,19.81 33.66,19.81 33.91,20.07 39.75,20.07 39.88,20.19 RA6.PAD
EXT_VREF
  Bottom 0.254: SJ280.3 10.77,11.43 7.11,11.43 6.86,11.18 6.6,11.18 5.97,10.54 5.97,8.51 6.48,8.13 6.6,8.13 8.38,6.35 8.38,1.52 9.14,0.76 39.62,0.76 39.75,0.89 RA7.PAD
FB
  Bottom 0.254: LV2C:GFE:U2203.FB 29.9,57.33 30.73,58.17 30.73,62.23 30.95,62.45 C2223.1 32.07,62.23 32.51,62.23 33.15,61.59 33.15,51.69 32.77,51.31 32.3,51.31 R2216.1
  Bottom 1.016: R2217.2 R2216.1
GND  (via drill 0.2, 0.2 pad 0.25)  (10 unrouted)
  Top 0.254: 25.02,65.96 C2201.2 | 25.52,71.03 C2205.2 | LV2C:GFE:U2201.VSS@5 25.82,15.75 v25.65,15.75 | LV2C:GFE:U2201.VSS@3 7.55,12.7 v7.24,12.83 | v20.7,10.92 20.83,10.84 LV2C:GFE:U2201.VSS@6 | LV2C:GFE:U2201.VSS@4 16.27,9.4 v16.51,9.4 | v23.5,24.77 23.5,24.4 LV2C:GFE:U2201.VSS | LV2C:GFE:U2201.VSS@1 15.62,24.53 v15.62,24.26 | LV2C:GFE:U2201.VSS@2 12,21.08 13.21,21.08 13.98,21.86 v14.24,21.86
  Top 0.406: R2218.2 5.59,50.31 v5.59,49.02 | v4.83,49.02 4.83,50.29 4.06,50.29 | 4.06,50.29 4.06,49.78 v3.56,49.53 | 4.06,50.29 v3.56,50.29
  Top 0.61: 16.76,60.2 v15.62,60.2 16.43,59.26 L2203.2 | v24.13,51.69 24.13,50.57 C2207.1 v23.5,51.69 | 25.02,65.96 25.02,68.2 25.52,68.7 LV2C:GFE:U2202.GND | Q2251.2 14.9,52.07 15.75,52.07 16.28,51.54 U2251.2 16.26,50.98 16.26,49.78 18.16,49.78 18.16,51.69 18.44,51.96 U2250.4 | v17.27,58.29 17.27,59.69 | C2206.- 24.35,43.22 21.73,45.83 Q2282.2 21.3,45.87 R2251.1 | TVS2201.A 27.01,57.11 | R2255.1 11.7,51.66 C2250.1
  Top 0.813: LV2C:GFE:U2202.GND 25.52,71.03 | R2206.1 28.56,72.25 28.96,72.64 | 28.96,72.64 28.96,74.71 C2203.1 | 28.96,72.64 29.27,72.96 R2202.1 | D2201.ANODE2 D2201.ANODE1 20.32,66.77 20.32,65.53 20.31,65.02 C2202.2
  Route2 0.254: v14.22,67.54 14.12,67.54
  Route2 0.406: v15.67,73.23 15.75,73.23
  Route2 0.61: v15.07,56.64 14.99,56.81
  Bottom 0.254: LV2C:GFE:U2203.PGND@1 LV2C:GFE:U2203.PGND | LV2C:GFE:U2203.GND 29.03,56 29.08,55.94 | 14.76,67.54 U$8.4 v14.22,67.54 | 14.73,6.6 16.51,8.38 v16.51,9.4 | 14.73,6.6 14.22,6.6 C12.2 13.84,6.35 13.72,6.35 12.57,5.21 12.57,4.06 v12.32,4.06 | D282.K 16.92,5.18 16.26,5.84 16.26,6.1 15.75,6.6 14.73,6.6 | C13.2 22.39,23.66 v23.5,24.77 | C287.1 13.22,21.89 v14.24,21.86 | C288.2 5.77,13.45 C283.1
  Bottom 0.305: R8.2 15.49,55.37 v15.07,56.64
  Bottom 0.406: LV2C:GFE:U2206.2 15.67,72.72 v15.67,73.23 | LV2C:GFE:U2204.PGND 26.42,56.56 26.42,60.71 C2221.1
  Bottom 0.61: v17.27,58.29 17.27,60.45 17.82,61 C6.1
  Bottom 0.813: 28.61,55.94 28.55,55.88 26.67,55.88 25.99,56.56 LV2C:GFE:U2204.PGND
  Bottom 1.016: C2224.1 30.86,56.39 29.08,55.94 28.61,55.94 LV2C:GFE:U2203.PGND@1 | C2252.1 26.64,43.58 C2252A.1 26.57,41.78 R2214.2
  Bottom 1.27: C2220.1 27.22,62.79 C2221.1
  other vias: 31.11,57.66 17.65,53.09 14.99,53.98 25.78,70.48 16,6.1 19.81,5.08 29.46,9.78 20.7,56.39 25.02,24
  pour Bottom (isolate 0.254, rank 4): 100.08,0 0,0 0,80.01 100.08,80.01 100.08,71.63
  pour Top (isolate 0.254, rank 4): 0,0 0,80.01 100.08,80.01 100.08,0
  pour Route2 (isolate 0.254, rank 4): 0,80.01 100.08,80.01 100.08,0 0,0
IN+
  Top 0.61: C2251.1 R2255.2 13.34,52.92 R2254.1 15.12,51.19 U2251.3
IN_CURRENT_LIMIT_PROG
  Bottom 0.254: LV2C:GFE:U2204.3 23.5,58.8 22.61,59.69 22.61,60.58 22.86,60.96 22.86,67.83 R2208.1
INV-INV  (2 unrouted)
  Bottom 0.254: U$8.5 U$8.6 | 15.49,68.33 16,68.33 | 16,68.07 15.49,68.07
  Bottom 0.305: R5.1 15.2,68.5 U$8.5
INV_DATA
  Bottom 0.254: 17.27,66.21 16.76,66.55 16.76,66.72 U$8.1 | R15.2 17.56,65.5
  Bottom 0.406: 17.02,66.29 16.64,66.67
  Bottom 0.61: 17.56,65.5 17.02,66.29 16.76,66.55
  Bottom 0.813: D1.K R15.2
IO_3P3  (via drill 0.2)
  Route15 0.254: v17.27,68.07 17.27,70.92 16.7,71.5 v15.62,71.5
  Bottom 0.254: U$8.8 17.27,67.54 v17.27,68.07
  Bottom 0.305: 17.89,67.54 U$8.8
  Bottom 0.406: LV2C:GFE:U2206.3 15.62,71.45 v15.62,71.5
  Bottom 0.61: R7.1 17.89,67.54
IO_GND  (1 unrouted)
  pour Bottom (rank 3): 9.91,61.98 10.67,62.74 13.46,62.74 14.22,61.98 14.22,58.17 15.24,57.15 17.53,57.15 17.53,54.86 14.99,54.86 13.21,53.09 9.91,53.09
L_IN
  Bottom 0.254: LV2C:GFE:U2203.L1 28.03,53.63 27.81,53.47
  Bottom 0.406: 27.81,53.34 27.81,53.47
  Bottom 0.813: 27.81,53.34 26.87,52.65 L2202.1
L_OUT
  Bottom 0.254: LV2C:GFE:U2203.L2 29.03,53.65 29.08,53.21 29.08,53.09
  Bottom 0.61: L2202.2 29.67,52.5
  Bottom 0.813: 29.67,52.5 29.08,53.09
  Bottom 1.016: L2202.2 29.67,47.81 CR2201.A
LED200_A
  Bottom 0.254: R290.2 18.68,5.31 D282.A
MAX_UVLO
  Top 0.406: U2250.6 21.7,50.93 21.34,50.93 20.49,50.08 R2250.1
  Top 0.61: R2250.1 19.6,49.08 R2251.2 18.66,47.01 Q2282.3
N$2
  Top 0.406: J2201.B+@1 J2201.B+@2
  Top 1.016: L2203.4 11.51,66.47 10.67,67.31 9.16,67.31 J2201.B+@2
N$3
  Top 0.254: LV2C:GFE:U2202.VC 28.85,69.24 29.45,69.84 R2203.2
N$4
  Top 0.254: LV2C:GFE:U2202.RT 27.32,69.74 27.43,69.85 28.7,69.85 29.86,71 R2202.2
N$5
  Top 0.813: R2203.1 31.05,68.14 31.75,68.83 31.75,74.42 31.5,74.68 30.82,74.68 C2203.2
N$6  (2 unrouted)
  Bottom 0.254: 14.99,66.55 15.49,67.06 | 14.99,66.29 15.49,66.8
  Bottom 0.305: 15.02,66.4 U$8.3
  Bottom 0.61: R6.2 15.02,66.4
N$7
  Bottom 0.813: D2202.1(ANODE) R2213.2
N$9  (via drill 0.2)
  other vias: 16.89,27.69
N$10
  Bottom 1.016: R2214.1 22.45,40.3 R2215.2
N_DRAIN
  Top 0.254: R2253.1 18.54,60.45 18.54,54 | 18.54,54 18.54,53.72 20.75,53.72 U2250.2 | Q2251.3 18.54,54
N_GATE
  Top 0.61: C2251.2 14.76,55.09 Q2251.1 15.41,54.95 16.26,54.1 16.26,53.21 17.23,52.24 U2251.1
NTC_INPUT_FROM_BATTERY
  Bottom 0.254: 21.63,42.55 21.72,42.55 22.61,43.43 22.61,43.69 23.5,44.58 23.5,45.85 23.62,45.97 23.62,48.64 23.75,48.77 24.64,48.77 25.5,49.63 LV2C:GFE:U2204.8
  Bottom 1.016: R2215.1 21.63,42.55 21.63,42.9 R2209.2
P_GATE
  Top 0.61: U2250.3 19.8,56.01 Q2250.3
PIC_LAMP
  Bottom 0.254: R289.1 21.7,7.7 D281.A
PORT0.0/RD1/TXD3/SDA1  (via drill 0.2)
  Top 0.254: LV2C:GFE:U2201.P0[0]/RD1/TXD3/SDA1 10.12,19.43 10.92,19.43 v11.18,19.68 | v32.13,34.42 32,34.42 30.35,32.77 27.94,32.77 27.56,33.15 26.42,33.15 25.65,33.91 25.27,33.91 25.02,34.16 24,34.16 v23.62,34.54
  Route2 0.254: v32.38,30.86 32.38,34.16 v32.13,34.42
  Route15 0.254: v32.38,30.86 32.77,31.24 34.54,31.24 34.77,31.01 J0.0.PAD
  Bottom 0.254: LV2C:GFE:U2206.4 17.45,70.18 21.21,66.42 21.21,62.61 19.94,61.34 19.94,59.82 19.3,59.18 19.3,52.45 17.53,50.67 17.53,42.04 18.67,40.89 18.67,36.07 20.19,34.54 v23.62,34.54 | v11.18,19.68 9.27,21.59 9.27,23.24 9.65,23.62 11.43,23.62 11.68,23.88 11.68,27.69 11.43,27.94 11.43,30.1 12.95,31.62 15.88,31.62 16.13,31.37 25.27,31.37 25.91,30.73 32.26,30.73 v32.38,30.86
PORT0.1/TD1/RXD3/SCL1  (via drill 0.2)
  Top 0.254: LV2C:GFE:U2201.P0[1]/TD1/RXD3/SCL1 8.38,20.46 8.38,28.19 11.43,31.24 | 11.43,31.24 12.32,32.13 18.16,32.13 18.54,32.51 22.1,32.51 22.48,32.13 24.38,32.13 24.64,31.88 25.02,31.88 25.78,31.11 26.92,31.11 27.3,30.73 31.37,30.73 32.38,31.75 37.72,31.75 37.82,31.85 J0.1.PAD | 11.43,31.24 11.43,31.75 v11.18,32 | v16.76,43.69 16.76,43.43 10.67,37.34 v10.67,35.81
  Route15 0.254: v11.18,32 10.54,32.64 10.54,35.69 v10.67,35.81
  Bottom 0.254: LV2C:GFE:U2206.1 15.32,73.99 14.73,73.41 14.73,70.1 15.49,69.34 16,69.34 16.55,68.79 U$8.7 16.55,68.83 17.78,68.83 20.7,65.91 20.7,62.87 19.43,61.59 19.43,60.07 18.8,59.44 18.8,52.58 17.02,50.8 17.02,43.94 v16.76,43.69
PORT0.2/TXD0  (via drill 0.2)
  Top 0.254: J0.2.PAD 36.7,15.37 36.58,15.49 35.56,15.49 | 35.56,15.49 34.16,15.49 33.78,15.11 33.78,14.61 32.77,13.59 32.77,12.83 31.75,11.81 31.75,11.43 30.73,10.41 29.59,10.41 29.34,10.67 29.34,11.56 27.94,12.95 27.94,14.34 LV2C:GFE:U2201.P0[2]/TXD0 26.15,16.13 v26.04,16.64 | J4.6.PAD 35.69,15.37 35.56,15.49 | v15.88,15.75 15.88,15.49 14.1,13.72 13.72,13.72 9.91,17.53 6.99,17.53 6.73,17.78 6.73,19.43 7.11,19.81 7.11,20.57 7.37,20.83 7.37,32.89 v7.11,33.15
  Route2 0.254: v15.88,15.75 16.13,15.75 16.89,16.51 25.91,16.51 v26.04,16.64
  Route15 0.254: v7.11,33.15 7.11,37.47 6.85,37.72 J2204.11
PORT0.3/RXD0  (via drill 0.2)
  Top 0.254: J4.5.PAD 36.72,16.14 36.58,16 34.04,16 33.27,15.24 33.27,14.73 32.26,13.72 32.26,12.95 31.24,11.94 31.24,11.68 30.48,10.92 30.1,10.92 | 30.1,10.92 29.97,10.92 29.84,11.05 29.84,11.81 28.45,13.21 28.45,14.53 LV2C:GFE:U2201.P0[3]/RXD0 26.67,16.31 v26.67,17.14 | 30.1,10.92 v30.1,11.05 | v1.65,27.3 1.4,27.05 1.4,17.53 1.91,17.02 9.65,17.02 15.49,11.18 16.76,11.18 17.65,12.06 18.8,12.06 23.37,16.64 v23.62,17.27
  Bottom 0.254: J0.3.PAD 34.68,15.35 34.54,15.49 34.16,15.49 33.78,15.11 33.78,14.61 32.77,13.59 32.77,12.83 31.75,11.81 31.75,11.43 30.73,10.41 30.35,10.41 30.1,10.67 v30.1,11.05 | J2204.12 3.69,37.72 3.3,37.34 3.3,28.19 2.41,27.3 v1.65,27.3 | v23.62,17.27 26.54,17.27 v26.67,17.14
PORT0.4/I2SRX_CLK/RD2/CAP2.0  (via drill 0.2)
  Top 0.254: v22.73,6.48 22.73,7.52 LV2C:GFE:U2201.P0[4]/I2SRX_CLK/RD2/CAP2[0] 20.09,10.16 19.94,10.16 v19.68,9.91
  Route15 0.254: v22.73,6.48 22.99,6.22 23.24,6.22 23.5,5.97 23.5,5.08 23.75,4.83 30.48,4.83 30.73,5.08 30.73,6.1 33.27,8.64 33.27,9.14 33.91,9.78 37.59,9.78 37.76,9.94 J0.4.PAD | v17.91,38.35 18.29,37.97 18.29,29.59 19.81,28.07 19.81,25.15 19.18,24.51 19.18,24.38 19.05,24.26 19.05,21.97 19.3,21.72 19.3,14.99 19.05,14.73 19.05,10.54 v19.68,9.91
  Bottom 0.254: R6.1 11.43,66 11.43,65.79 12.95,64.26 13.72,64.26 14.73,63.25 14.73,58.93 16,57.66 18.03,57.66 18.29,57.4 18.29,52.7 16.51,50.93 16.51,44.7 16.13,44.32 16.13,43.31 16.38,43.05 16.76,43.05 17.02,42.8 17.02,41.78 18.16,40.64 18.16,38.48 v17.91,38.35
  Bottom 0.406: R5.2 LV2C:GFE:U2206.5
  Bottom 0.813: R6.1 R5.2
PORT0.5/I2SRX_WS/TD2/CAP2.1  (via drill 0.2)
  Top 0.254: LV2C:GFE:U2201.P0[5]/I2SRX_WS/TD2/CAP2[1] 21.84,7.7 21.84,5.84 22.23,5.46 v22.73,5.46
  Bottom 0.254: v22.73,5.46 22.86,5.33 22.86,4.95 22.99,4.83 30.48,4.83 30.73,5.08 30.73,6.1 33.27,8.64 33.27,9.14 33.91,9.78 38.61,9.78 38.77,9.94 J0.5.PAD
PORT0.6/I2SRX_SDA/SSEL1/MAT2.0
  Top 0.254: LV2C:GFE:U2201.P0[6]/I2SRX_SDA/SSEL1/MAT2[0] 21.34,7.5 21.34,5.08 21.59,4.83 30.48,4.83 30.73,5.08 30.73,6.1 33.27,8.64 33.27,9.14 33.91,9.78 39.62,9.78 39.79,9.94 J0.6.PAD
PORT0.7/I2STX_CLK/SCK1/MAT2.1
  Top 0.254: LV2C:GFE:U2201.P0[7]/I2STX_CLK/SCK1/MAT2[1] 20.83,7.3 20.83,6.6 20.07,5.84 19.05,5.84 17.78,4.57 17.78,4.32 30.99,4.32 31.24,4.57 31.24,5.84 33.78,8.38 33.78,8.89 34.16,9.27 34.54,9.27 34.71,9.11 J0.7.PAD
PORT0.8/I2STX_WS/MISO1/MAT2.2  (via drill 0.2)
  Top 0.254: LV2C:GFE:U2201.P0[8]/I2STX_WS/MISO1/MAT2[2] 20.32,7.11 20.32,6.86 19.81,6.35 18.8,6.35 17.27,4.83 16.13,4.83 v15.75,4.45
  Bottom 0.254: v15.75,4.45 15.88,4.32 30.99,4.32 31.24,4.57 31.24,5.84 33.78,8.38 33.78,8.89 34.16,9.27 35.56,9.27 35.73,9.11 J0.8.PAD
PORT0.9/I2STX_SDA/MOSI1/MAT2.3  (via drill 0.2)
  Top 0.254: LV2C:GFE:U2201.P0[9]/I2STX_SDA/MOSI1/MAT2[3] 17.01,5.33 v15.62,5.33
  Route15 0.254: v15.62,5.33 16.26,5.33 17.27,4.32 30.99,4.32 31.24,4.57 31.24,5.84 33.78,8.38 33.78,8.89 34.16,9.27 36.58,9.27 36.74,9.11 J0.9.PAD
PORT0.10/TXD2/SDA2/MAT3.0  (via drill 0.2)
  Top 0.254: LV2C:GFE:U2201.P0[10]/TXD2/SDA2/MAT3[0] 9.34,18.8 9.91,18.8 10.03,18.92 11.43,18.92 v12.19,19.68
  Bottom 0.254: v12.19,19.68 11.43,18.92 10.92,18.92 10.03,19.81 10.03,20.07 8.76,21.34 8.76,23.37 9.53,24.13 11.05,24.13 11.18,24.26 11.18,27.43 10.92,27.69 10.92,30.23 12.83,32.13 16.13,32.13 16.38,31.88 25.4,31.88 26.04,31.24 31.88,31.24 32.38,31.75 36.7,31.75 36.8,31.85 J0.10.PAD
PORT0.11/RXD2/SCL2/MAT3.1  (via drill 0.2)
  Top 0.254: LV2C:GFE:U2201.P0[11]/RXD2/SCL2/MAT3[1] 7.75,19.68 7.75,20.45 7.87,20.57 7.87,28.32 10.41,30.86 10.41,32.13 10.92,32.64 18.03,32.64 18.41,33.02 22.23,33.02 22.61,32.64 24.51,32.64 24.77,32.38 25.15,32.38 25.91,31.62 27.05,31.62 27.43,31.24 31.24,31.24 32.38,32.38 v33.53,32.38
  Route15 0.254: v33.53,32.38 34.16,31.75 35.69,31.75 35.79,31.85 J0.11.PAD
PORT0.15/TXD1/SCK0/SCK
  Top 0.254: J0.15.PAD 36.7,5.08 36.58,5.21 33.66,5.21 33.27,4.83 33.27,2.54 33.02,2.29 10.16,2.29 9.91,2.54 9.91,7.11 9.02,8 9.02,8.76 9.53,9.27 9.53,9.72 LV2C:GFE:U2201.P0[15]/TXD1/SCK0/SCK
PORT0.16/RXD1/SSEL0/SSEL  (via drill 0.2)
  Top 0.254: LV2C:GFE:U2201.P0[16]/RXD1/SSEL0/SSEL 10.03,9.53 10.03,8.89 9.65,8.51 v9.65,8.38
  Bottom 0.254: J0.16.PAD 35.69,5.08 35.56,5.21 33.66,5.21 33.27,4.83 33.27,2.54 33.02,2.29 10.16,2.29 9.91,2.54 9.91,7.11 9.65,7.37 v9.65,8.38
PORT0.17/CTS1/MISO0/MISO  (via drill 0.2)
  Top 0.254: LV2C:GFE:U2201.P0[17]/CTS1/MISO0/MISO 9.02,9.92 9.02,9.4 v8.38,8.76
  Route15 0.254: J0.17.PAD 37.72,3.68 37.59,3.56 34.04,3.56 33.78,3.3 33.78,2.03 33.53,1.78 9.65,1.78 9.4,2.03 9.4,6.86 8.38,7.87 v8.38,8.76
PORT0.18/DCD1/MOSI0/MOSI  (via drill 0.2)
  Top 0.254: LV2C:GFE:U2201.P0[18]/DCD1/MOSI0/MOSI 8.38,9.99 v7.75,9.4
  Bottom 0.254: v7.75,9.4 7.75,8.51 9.4,6.86 9.4,2.03 9.65,1.78 33.53,1.78 33.78,2.03 33.78,3.3 34.04,3.56 38.61,3.56 38.73,3.68 J0.18.PAD
PORT0.19/DSR1/MCICLK/SDA1
  Top 0.254: J0.19.PAD 39.75,3.68 39.62,3.56 34.04,3.56 33.78,3.3 33.78,2.03 33.53,1.78 9.65,1.78 9.4,2.03 9.4,6.86 7.11,9.14 7.11,9.78 7.37,10.03 7.71,10.03 LV2C:GFE:U2201.P0[19]/DSR1/MCICLK/SDA1
PORT0.20/DTR1/MCICMD/SCL1  (via drill 0.2)
  Top 0.254: LV2C:GFE:U2201.P0[20]/DTR1/MCICMD/SCL1 9.14,12.17 8.89,11.94 7.49,10.54 v6.86,10.54
  Bottom 0.254: v6.86,10.54 6.86,8.64 8.89,6.6 8.89,1.78 9.4,1.27 34.54,1.27 34.67,1.4 J0.20.PAD
PORT0.21/RI1/MCIPWR/RD1  (via drill 0.2)
  Top 0.254: v5.33,10.03 5.33,11.18 5.59,11.43 7.7,11.43 LV2C:GFE:U2201.P0[21]/RI1/MCIPWR/RD1
  Route15 0.254: v5.33,10.03 5.33,9.4 5.59,9.14 6.35,9.14 8.89,6.6 8.89,1.78 9.4,1.27 35.56,1.27 35.69,1.4 J0.21.PAD
PORT0.22/RTS1/MCIDAT0/TD1  (via drill 0.2)
  Top 0.254: LV2C:GFE:U2201.P0[22]/RTS1/MCIDAT0/TD1 8.13,12.57 7.49,11.94 5.08,11.94 4.7,11.56 v4.7,10.67
  Route15 0.254: v4.7,10.67 4.7,9.14 5.08,8.64 6.1,8.64 8.38,6.35 8.38,1.52 9.14,0.76 36.58,0.76 36.7,0.89 J0.22.PAD
PORT0.23/AD0.0/I2SRX_CLK/CAP3.0  (via drill 0.2)
  Top 0.254: LV2C:GFE:U2201.P0[23]/AD0[0]/I2SRX_CLK/CAP3[0] 26.45,23.11 29.08,23.11 30.73,21.46 31.37,21.46 31.88,20.95 32.13,20.95 32.51,20.57 32.89,20.57 v33.02,20.45
  Route15 0.254: v33.02,20.45 33.91,20.45 34.29,20.07 38.73,20.07 38.88,20.21 J0.23.PAD
PORT0.24/AD0.1/I2SRX_WS/CAP3.1
  Top 0.254: LV2C:GFE:U2201.P0[24]/AD0[1]/I2SRX_WS/CAP3[1] 26.65,22.61 28.96,22.61 30.61,20.95 31.24,20.95 31.75,20.45 32,20.45 32.38,20.07 32.51,20.07 32.77,19.81 33.78,19.81 34.04,19.56 39.62,19.56 39.74,19.44 J0.24.PAD
PORT0.25/AD0.2/I2SRX_SDA/TXD3  (via drill 0.2)
  Top 0.254: LV2C:GFE:U2201.P0[25]/AD0[2]/I2SRX_SDA/TXD3 26.85,22.1 28.83,22.1 30.48,20.45 31.11,20.45 31.62,19.94 31.88,19.94 32.26,19.56 32.38,19.56 32.64,19.3 33.27,19.3 v33.4,19.18
  Bottom 0.254: v33.4,19.18 33.66,19.18 34.04,19.56 38.61,19.56 38.75,19.42 J0.25.PAD
PORT0.26/AD0.3/AOUT/RXD3  (via drill 0.2)
  Top 0.254: LV2C:GFE:U2201.P0[26]/AD0[3]/AOUT/RXD3 27.05,21.59 28.7,21.59 30.35,19.94 30.99,19.94 32.26,18.67 v32.38,18.67
  Route15 0.254: v32.38,18.67 32.64,18.92 32.64,19.56 32.77,19.81 33.78,19.81 34.04,19.56 37.59,19.56 37.73,19.42 J0.26.PAD
PORT0.27/SDA0
  Top 0.254: LV2C:GFE:U2201.P0[27]/SDA0 19.96,27.94 20.7,27.94 21.08,27.56 23.11,27.56 23.37,27.3 23.88,27.3 24.64,26.54 25.27,26.54 25.65,26.16 29.84,26.16 31.5,24.51 32.13,24.51 32.51,24.13 33.4,24.13 33.91,23.62 38.73,23.62 38.88,23.48 J0.27.PAD
PORT0.28/SCL0  (via drill 0.2)
  Top 0.254: LV2C:GFE:U2201.P0[28]/SCL0 20.16,27.43 20.57,27.43 20.95,27.05 22.99,27.05 23.24,26.8 23.75,26.8 24.51,26.04 25.15,26.04 25.53,25.65 29.72,25.65 31.37,24 32,24 32.38,23.62 33.27,23.62 33.78,23.11 v33.78,22.73
  Bottom 0.254: v33.78,22.73 33.78,23.24 34.16,23.62 37.72,23.62 37.86,23.48 J0.28.PAD
PORT0.29/USB_D+  (via drill 0.2)
  Top 0.254: LV2C:GFE:U2201.P0[29]/USB_D+ 16.42,25.15 18.16,25.15 v18.41,25.4
  Route15 0.254: v18.41,25.4 18.8,25.78 18.8,27.56 17.27,29.08 17.27,36.45 14.22,39.5 14.22,39.88 v11.56,42.55
  Bottom 0.254: R281.2 10.2,50.29 | v18.41,25.4 18.67,25.65 20.83,25.65 21.34,26.16 21.34,27.43 21.72,27.81 24.13,27.81 26.04,25.91 34.16,25.91 34.42,25.65 36.7,25.65 36.8,25.55 J0.29.PAD | v11.56,42.55 9.91,44.2 9.91,47.75 9.53,48.13 C290.2
  Bottom 0.813: C290.2 R281.2
PORT0.30/USB_D-  (via drill 0.2)
  Top 0.254: LV2C:GFE:U2201.P0[30]/USB_D- 14.48,26.38 14.48,26.67 16.26,28.45 17.78,28.45 | 17.78,28.45 19.18,28.45 19.68,28.96 21.08,28.96 21.46,28.57 23.37,28.57 23.62,28.32 24.13,28.32 24.89,27.56 25.53,27.56 25.91,27.18 30.1,27.18 31.75,25.53 32.51,25.53 32.77,25.27 v33.66,25.27 | 17.78,28.45 v17.78,27.69
  Route15 0.254: v33.66,25.27 34.04,25.65 35.69,25.65 35.79,25.55 J0.30.PAD | v17.78,27.69 17.65,27.81 17.65,27.94 16.76,28.83 16.76,35.56 v16.51,35.81
  Bottom 0.254: 15.38,49.53 16,48.91 16,45.09 15.62,44.7 15.62,43.18 16.51,42.29 16.51,41.53 17.14,40.89 17.14,38.1 16.51,37.47 v16.51,35.81
  Bottom 0.61: C289.2 13.2,49.52 13.21,49.53
  Bottom 1.016: 13.21,49.53 15.38,49.53 R282.2
PORT1.0/GPIO_SPS_DISABLE  (via drill 0.2)
  Top 0.254: J1.0.PAD 37.74,14.12 37.59,13.97 33.91,13.97 33.27,13.34 33.27,12.57 32.26,11.56 32.26,11.18 31.24,10.16 31.24,9.65 29.84,8.26 29.59,8.26 28.83,9.02 28.83,11.32 LV2C:GFE:U2201.P1[0]/ENET_TXD0 24.64,15.52 v24.64,15.75 | v21.72,35.43 21.59,35.56 21.59,43.61 Q2282.1
  Route15 0.254: v24.64,15.75 24.38,16 24.38,18.16 23.37,19.18 23.37,21.34 25.91,23.88 25.91,24.38 25.53,24.77 25.53,25.15 24,26.67 24,26.92 22.99,27.94 22.99,28.83 21.34,30.48 21.34,35.05 v21.72,35.43
PORT1.1/GPIO_SPS_V-IN_GOOD  (via drill 0.2)
  Top 0.254: U2250.5 20.75,51.49 20.32,51.05 19.81,51.05 19.3,50.55 v19.3,50.04 | v28.7,8.26 28.32,8.64 28.32,11.13 LV2C:GFE:U2201.P1[1]/ENET_TXD1 24.46,14.99 v24.13,14.99
  Route15 0.254: v24.13,14.99 22.86,16.26 22.86,21.59 22.99,21.72 22.99,22.73 22.73,22.99 22.23,22.99 21.97,23.24 21.97,28.45 20.32,30.1 20.32,35.94 v20.7,36.32
  Bottom 0.254: v28.7,8.26 29.08,7.87 29.46,7.87 31.24,9.65 31.24,10.16 32.26,11.18 32.26,11.56 33.27,12.57 33.27,13.34 33.91,13.97 38.61,13.97 38.76,14.12 J1.1.PAD | v19.3,50.04 18.03,48.77 18.03,42.29 19.18,41.15 19.18,36.32 19.68,35.81 20.19,35.81 v20.7,36.32
PORT1.4/GPIO_SPS_5V-OUT_GOOD  (via drill 0.2)
  Top 0.254: LV2C:GFE:U2202.PG 27.78,68.24 28.96,67.06 28.96,63.37 30.48,61.85 30.48,57.66 29.46,56.64 29.46,52.2 29.97,51.69 29.97,49.15 30.23,48.9 v30.23,44.45 | LV2C:GFE:U2201.P1[4]/ENET_TX_EN 27.81,10.93 27.81,8.26 28.57,7.49 v28.57,7.24
  Route15 0.254: v28.57,7.24 28.83,7.24 29.46,7.87 | 29.46,7.87 31.24,9.65 31.24,10.16 32.26,11.18 32.26,11.56 33.27,12.57 33.27,13.34 33.91,13.97 39.62,13.97 39.77,14.12 J1.4.PAD | 29.46,7.87 29.46,8.38 28.83,9.02 28.83,10.29 29.34,10.79 29.34,11.3 29.84,11.81 29.84,12.32 30.1,12.57 31.11,12.57 31.75,13.21 31.75,13.84 32.77,14.86 32.77,16.13 32.38,16.51 32,16.51 31.75,16.76 31.75,19.05 32.13,19.43 32.13,20.45 32.26,20.57 32.26,23.5 32.77,24 32.77,27.05 32.13,27.69 31.88,27.69 31.37,28.19 31.37,30.73 30.73,31.37 30.73,32.51 32,33.78 33.4,33.78 33.53,33.91 v33.53,34.54
  Bottom 0.254: v30.23,44.45 32.38,44.45 32.64,44.2 32.64,34.8 32.89,34.54 v33.53,34.54
PORT1.8/GPIO_CHARGER_DISABLE_A  (via drill 0.2)
  Top 0.254: v27.81,6.99 27.81,7.37 27.3,7.87 27.3,10.73 LV2C:GFE:U2201.P1[8]/ENET_CRS 23.81,14.22 v22.61,14.22
  Route2 0.254: v22.61,37.08 22.61,48.01 21.34,49.28 21.34,51.82 22.48,52.96 22.61,52.96 22.99,53.34 22.99,56.64 23.36,57.02 v23.36,59.82
  Route15 0.254: v27.81,6.99 27.69,6.86 27.69,6.48 27.81,6.35 29.08,6.35 29.21,6.48 29.21,6.86 31.75,9.4 31.75,9.91 32.77,10.92 32.77,11.3 33.78,12.32 33.78,13.08 34.16,13.46 34.54,13.46 34.69,13.31 J1.8.PAD | v22.61,14.22 22.35,14.48 21.72,14.48 21.08,15.11 21.08,18.54 21.72,19.18 21.72,22.61 21.46,22.86 21.46,28.32 19.81,29.97 19.81,36.7 v20.07,36.96
  Bottom 0.254: LV2C:GFE:U2204.4 24,58.93 23.37,59.56 v23.37,59.81 v23.36,59.82 | v20.07,36.96 20.19,37.08 v22.61,37.08
PORT1.9/GPIO_CHARGER_DISABLE_B  (via drill 0.2)
  Top 0.254: v26.92,7.11 26.92,7.37 26.8,7.49 26.8,10.53 LV2C:GFE:U2201.P1[9]/ENET_RXD0 23.61,13.72 22.99,13.72 22.61,13.59 v21.97,13.59
  Route2 0.254: v23.62,37.85 23.11,38.35 23.11,48.26 21.84,49.53 21.84,51.56 22.73,52.45 22.86,52.45 23.5,53.09 23.5,56.39 24.25,57.14 v24.25,59.68
  Route15 0.254: v21.97,13.59 21.84,13.59 20.57,14.86 20.57,18.8 21.21,19.43 21.21,22.48 20.95,22.73 20.95,28.19 19.3,29.84 19.3,37.21 v19.94,37.85
  Bottom 0.254: v24.25,59.68 24.25,59.42 24.5,59.17 LV2C:GFE:U2204.5 | v26.92,7.11 26.8,6.99 26.8,6.48 26.92,6.35 29.08,6.35 29.21,6.48 29.21,6.86 31.75,9.4 31.75,9.91 32.77,10.92 32.77,11.3 33.78,12.32 33.78,13.08 34.16,13.46 35.56,13.46 35.71,13.31 J1.9.PAD | v19.94,37.85 v23.62,37.85
PORT1.10/GPIO_!BAT_CHARGING!  (via drill 0.2)
  Top 0.254: J1.10.PAD 36.73,13.31 36.58,13.46 34.16,13.46 33.78,13.08 33.78,12.32 32.77,11.3 32.77,10.92 31.75,9.91 31.75,9.4 29.21,6.86 29.21,6.48 29.08,6.35 26.42,6.35 26.29,6.48 26.29,10.33 LV2C:GFE:U2201.P1[10]/ENET_RXD1 23.41,13.21 22.86,13.21 v22.61,12.95
  Route15 0.254: v22.61,12.95 22.35,12.7 19.68,12.7 19.56,12.83 19.56,14.48 20.07,14.99 20.07,18.92 20.7,19.56 20.7,22.35 20.45,22.61 20.45,28.07 18.8,29.72 18.8,37.85 v19.81,38.86
  Bottom 0.254: LV2C:GFE:U2204.11 24,53.97 23.62,53.59 arc53 23.37,52.83 23.37,52.7 22.73,52.07 22.73,51.44 23.33,50.84 D2202.2(CATHODE) 22.86,49.92 22.86,49.53 22.61,49.28 22.61,46.74 22.48,46.61 22.48,46.35 22.1,45.97 20.57,45.97 20.32,45.72 20.32,41.4 19.81,40.89 v19.81,38.86
PORT1.14/GPIO_HAP_3.3V_DISABLE  (via drill 0.2)
  Top 0.254: LV2C:GFE:U2201.P1[14]/ENET_RX_ER 25.78,10.13 25.78,6.73 v25.53,6.48
  Route15 0.254: J1.14.PAD 37.82,11.91 37.72,11.81 34.04,11.81 33.27,11.05 33.27,10.67 32.26,9.65 32.26,9.14 29.72,6.6 29.72,6.1 29.46,5.84 25.65,5.84 25.53,5.97 v25.53,6.48 26.29,7.24 26.29,7.75 26.42,7.87 27.3,7.87 28.32,8.89 28.32,10.54 28.83,11.05 28.83,11.56 29.34,12.06 29.34,12.45 29.97,13.08 30.86,13.08 31.24,13.46 31.24,13.97 32.26,14.99 32.26,15.88 32.13,16 31.5,16 31.24,16.26 31.24,19.43 31.62,19.81 31.62,20.57 31.75,20.7 31.75,23.62 32.26,24.13 32.26,26.92 32,27.18 31.75,27.18 30.86,28.07 30.86,30.48 30.23,31.11 30.23,32.77 31.37,33.91 31.37,34.8 31.88,35.31 32.64,35.31 33.53,36.32 v34.04,36.32
  Bottom 0.254: R4.1 33.25,65.79 33.27,65.79 33.66,65.41 33.66,36.83 34.04,36.45 v34.04,36.32
PORT1.15/GPIO_SPS_5V_PWR_GOOD  (via drill 0.2)
  Top 0.254: LV2C:GFE:U2201.P1[15]/ENET_REF_CLK 25.27,9.93 25.27,7.11 v24.64,6.48
  Bottom 0.254: v24.64,6.48 24.38,6.22 24.38,5.97 24.51,5.84 29.46,5.84 29.72,6.1 29.72,6.6 32.26,9.14 32.26,9.65 33.27,10.67 33.27,11.05 34.04,11.81 38.73,11.81 38.84,11.91 J1.15.PAD
PORT1.16/ENET_MDC  (via drill 0.2)